# Altium project X98_CARRIER_V1R2.PrjPcb (part 3 of 3)

## Sheet 11 EXPANSION CN.SchDoc
size A3; Organization: Protel International P/L; Address1: L3, 12a Rodborough Rd; Address2: Frenchs Forest; Address3: NSW; Address4: Australia 2086; SPICEModelCacheQOLTSZGZ: <root> / <DocumentId>QOLTSZGZ</DocumentId> / </root>
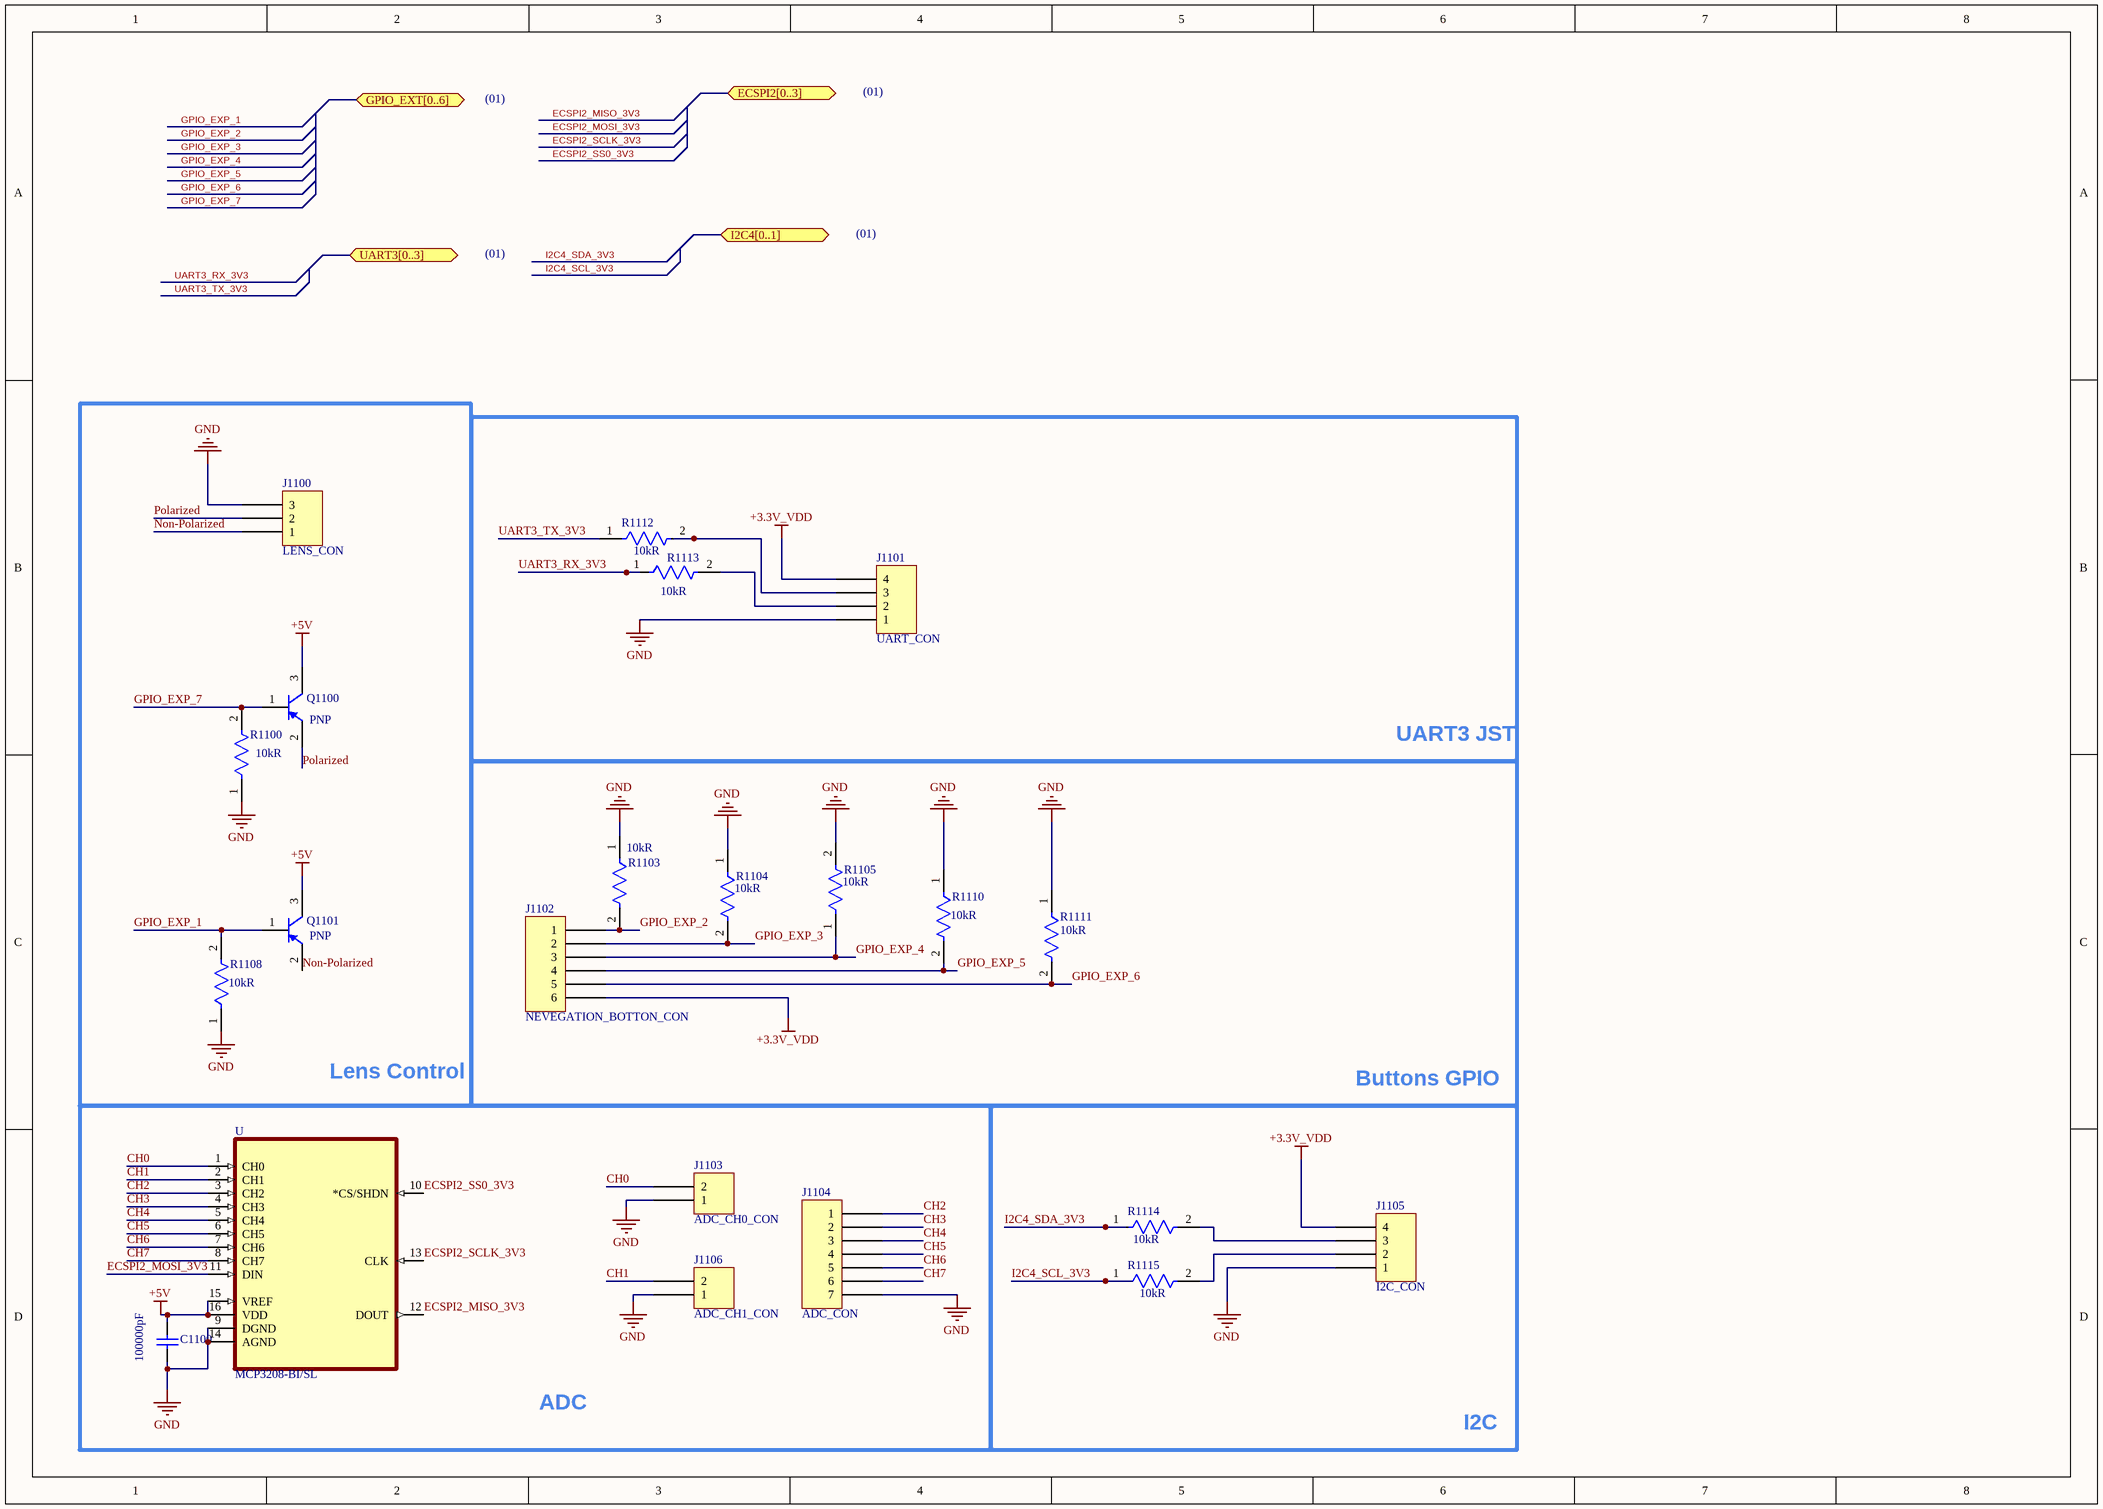
[diagram p13: 11 EXPANSION CN.SchDoc]

### Parts
C1100  Capacitance: 100000pF  [CAPC1050X55X23ML05T13]  (hidden comment: CL05B104KO5NNNC)
J1100  LENS_CON  [HIROSE DF13-3P-1.25H]
J1101  UART_CON  [HIROSE DF13A-4P-1.25H]
J1102  NEVEGATION_BOTTON_CON  [HIROSE DF13A-6P-1.25H]
J1103  ADC_CH0_CON  [HIROSE DF13-2P-1.25H]
J1104  ADC_CON  [JST SM07B-SRSS-TB]
J1105  I2C_CON  [HIROSE DF13A-4P-1.25H]
J1106  ADC_CH1_CON  [HIROSE DF13-2P-1.25H]
Q1100  Polarity: PNP  [ONSC-SOT-23-3-318-08_V]  (hidden comment: BC807-40LT1G)
Q1101  Polarity: PNP  [ONSC-SOT-23-3-318-08_V]  (hidden comment: BC807-40LT1G)
R1100  Resistance: 10kR  [FP-RMCF0603-IPC_C]  (hidden comment: RMCF0603JT10K0)
R1103  Resistance: 10kR  [FP-RMCF0603-IPC_C]  (hidden comment: RMCF0603JT10K0)
R1104  Resistance: 10kR  [FP-RMCF0603-IPC_C]  (hidden comment: RMCF0603JT10K0)
R1105  Resistance: 10kR  [FP-RMCF0603-IPC_C]  (hidden comment: RMCF0603JT10K0)
R1108  Resistance: 10kR  [FP-RMCF0603-IPC_C]  (hidden comment: RMCF0603JT10K0)
R1110  Resistance: 10kR  [FP-RMCF0603-IPC_C]  (hidden comment: RMCF0603JT10K0)
R1111  Resistance: 10kR  [FP-RMCF0603-IPC_C]  (hidden comment: RMCF0603JT10K0)
R1112  Resistance: 10kR  [FP-RMCF0603-IPC_C]  (hidden comment: RMCF0603JT10K0)
R1113  Resistance: 10kR  [FP-RMCF0603-IPC_C]  (hidden comment: RMCF0603JT10K0)
R1114  Resistance: 10kR  [FP-RMCF0603-IPC_C]  (hidden comment: RMCF0603JT10K0)
R1115  Resistance: 10kR  [FP-RMCF0603-IPC_C]  (hidden comment: RMCF0603JT10K0)
U  MCP3208-BI/SL  [SOIC127P600X175-16N]

### Blocks framed on the sheet
Lens Control: J1100 Q1100 Q1101 R1100 R1108
UART3 JST: J1101 R1112 R1113
ADC: C1100 J1103 J1104 J1106 U

### Ports
ECSPI2[0..3] (bidir), GPIO_EXT[0..6] (bidir), I2C4[0..1] (bidir), UART3[0..3] (bidir)

### Nets
+3.3V_VDD: J1101.4 J1102.6 J1105.4
+5V: C1100.2 Q1100.3(C) Q1101.3(C) U.15(VREF) U.16(VDD)
GND: C1100.1 J1100.3 J1101.1 J1103.1 J1104.7 J1105.1 J1106.1 R1100.1 R1103.1 R1104.1 R1105.2 R1108.1 R1110.1 R1111.1 U.9(DGND) U.14(AGND)
CH0: J1103.2 U.1(CH0)
CH1: J1106.2 U.2(CH1)
CH2: J1104.1 U.3(CH2)
CH3: J1104.2 U.4(CH3)
CH4: J1104.3 U.5(CH4)
CH5: J1104.4 U.6(CH5)
CH6: J1104.5 U.7(CH6)
CH7: J1104.6 U.8(CH7)
ECSPI2_MISO_3V3: U.12(DOUT)
ECSPI2_MOSI_3V3: U.11(DIN)
ECSPI2_SCLK_3V3: U.13(CLK)
ECSPI2_SS0_3V3: U.10(*CS/SHDN)
GPIO_EXP_1: Q1101.1(B) R1108.2
GPIO_EXP_2: J1102.1 R1103.2
GPIO_EXP_3: J1102.2 R1104.2
GPIO_EXP_4: J1102.3 R1105.1
GPIO_EXP_5: J1102.4 R1110.2
GPIO_EXP_6: J1102.5 R1111.2
GPIO_EXP_7: Q1100.1(B) R1100.2
I2C4_SCL_3V3: R1115.1
I2C4_SDA_3V3: R1114.1
Non-Polarized: J1100.1 Q1101.2(E)
Polarized: J1100.2 Q1100.2(E)
UART3_RX_3V3: R1113.1
UART3_TX_3V3: R1112.1
NetJ1101_2: J1101.2 R1113.2
NetJ1101_3: J1101.3 R1112.2
NetJ1105_2: J1105.2 R1115.2
NetJ1105_3: J1105.3 R1114.2

### Notes on the sheet
- (01)
- Buttons GPIO
- I2C
- Sheet Title:
- Inventron
- Size:
- Drawn By:
- Revision:
- Project:
- Checked By:
- A4
- Sheet
- of
- Budotek Teknopark
- Dudullu OSB
- Des 2. Cadde No:8/30
- Umraniye / ISTANBUL
- Electronics and Software
- Date:
- Time:
- ©2020 Inventron Electronics and Software. All rights reserved.

### Library data of the parts
C1100 = CMP-2000-05439-1: Chip Capacitor, 100 nF, +/- 10%, 16 V, -55 to 125 degC, 0402 (1005 Metric), RoHS, Tape and Reel; Manufacturer-1: Samsung Electro-Mechanics; Dielectric: X7R; Rated Voltage: 16V; Case Size/Dimension: 0402; Tolerance (%): ±10%; Manufacturer URL: http://www.samsungsem.com/global/index.jsp; Datasheet URL: https://datasheet.ciiva.com/29198/458718-da-01-en-vs-kondensator-0402-29198423.pdf; Datasheet Version: Nov-10; Manufacturer Part Number-1: CL05B104KO5NNNC; Class: Capacitor
J1100 = DF13-3P-1.25H(75): CONN HEADER SMD R/A 3POS 1.25MM; Manufacturer: Hirose Electric Co Ltd; Current Rating (Amps): 1A; Material Flammability Rating: UL94 V-0; Number of Positions: 3; Number of Positions Loaded: All; Pitch - Mating: 0.049" (1.25mm); Shrouding: Shrouded - 4 Wall; Style: Board to Cable/Wire; Voltage Rating: 150V; Part Number: DF13-3P-1.25H(75); ComponentLink1Description: Datasheet; ComponentLink1URL: https://www.hirose.com/product/document?clcode=CL0536-0109-0-76&productname=DF13-10P-1.25DSA(76)&series=DF13&documenttype=Catalog&lang=en&documentid=D31687_en; ComponentLink2Description: DigiKey Link; ComponentLink2URL: //digikey.com/product-detail/en/hirose-electric-co-ltd/DF13-3P-1.25H-75/H126394-ND/9170627; Connector Type: Header; Contact Finish - Mating: Tin; Contact Finish - Post: Tin; Contact Finish Thickness - Mating: 39.4µin (1.00µm); Contact Material: Brass; Contact Shape: Square; Contact Type: Male Pin; Fastening Type: Detent Lock; Features: Board Guide, Solder Retention; Insulation Color: Beige; Insulation Height: 0.142" (3.60mm); Insulation Material: Polyamide (PA), Nylon; LastUpdated: 12/16/2019 7:22:47 PM; Lifecycle Status: 0; Minimum Order: 1; Mounting Type: Surface Mount, Right Angle; Number of Rows: 1; Operating Temperature: -35°C ~ 85°C; Packaging: Tube; PartId: 2; Part Status: Active; Price: 0.41; Series: DF13; Supplier 1: DigiKey; Supplier Part Number 1: H126394-ND; Termination: Solder
J1101 J1105 = DF13A-4P-1.25H(75): CONN HEADER SMD R/A 4POS 1.25MM; Manufacturer: Hirose Electric Co Ltd; Current Rating (Amps): 1A; Material Flammability Rating: UL94 V-0; Number of Positions: 4; Number of Positions Loaded: All; Pitch - Mating: 0.049" (1.25mm); Shrouding: Shrouded - 4 Wall; Style: Board to Cable/Wire; Voltage Rating: 150V; Part Number: DF13A-4P-1.25H(75); ComponentLink1Description: Datasheet; ComponentLink1URL: https://www.hirose.com/product/download/?distributor=digikey&type=specSheet&lang=en&num=DF13A-4P-1.25H(75); ComponentLink2Description: DigiKey Link; ComponentLink2URL: //digikey.com/product-detail/en/hirose-electric-co-ltd/DF13A-4P-1.25H-75/H126438-ND/9170678; Connector Type: Header; Contact Finish - Mating: Tin; Contact Finish - Post: Tin; Contact Finish Thickness - Mating: 39.4µin (1.00µm); Contact Material: Brass; Contact Shape: Square; Contact Type: Male Pin; Fastening Type: Detent Lock; Features: Solder Retention; Insulation Color: Beige; Insulation Height: 0.142" (3.60mm); Insulation Material: Polyamide (PA), Nylon; LastUpdated: 12/16/2019 7:34:28 PM; Lifecycle Status: 0; Minimum Order: 1; Mounting Type: Surface Mount, Right Angle; Number of Rows: 1; Operating Temperature: -35°C ~ 85°C; Packaging: Tube; PartId: 8; Part Status: Active; Price: 0.45; Series: DF13; Supplier 1: DigiKey; Supplier Part Number 1: H126438-ND; Termination: Solder
J1102 = DF13A-6P-1.25H(75): CONN HEADER SMD R/A 6POS 1.25MM; Manufacturer: Hirose Electric Co Ltd; Current Rating (Amps): 1A; Material Flammability Rating: UL94 V-0; Number of Positions: 6; Number of Positions Loaded: All; Pitch - Mating: 0.049" (1.25mm); Shrouding: Shrouded - 4 Wall; Style: Board to Cable/Wire; Voltage Rating: 150V; Part Number: DF13A-6P-1.25H(75); ComponentLink1Description: Datasheet; ComponentLink1URL: https://www.hirose.com/product/document?clcode=CL0536-0109-0-76&productname=DF13-10P-1.25DSA(76)&series=DF13&documenttype=Catalog&lang=en&documentid=D31687_en; ComponentLink2Description: DigiKey Link; ComponentLink2URL: http://digikey.com/product-detail/en/hirose-electric-co-ltd/DF13A-6P-1.25H-75/H126442-ND/9170682; Connector Type: Header; Contact Finish - Mating: Tin; Contact Finish - Post: Tin; Contact Finish Thickness - Mating: 39.4µin (1.00µm); Contact Material: Brass; Contact Shape: Square; Contact Type: Male Pin; Fastening Type: Detent Lock; Features: Solder Retention; Insulation Color: Beige; Insulation Height: 0.142" (3.60mm); Insulation Material: Polyamide (PA), Nylon; LastUpdated: 1/15/2020 3:36:45 AM; Lifecycle Status: Active; Minimum Order: 1; Mounting Type: Surface Mount, Right Angle; Number of Rows: 1; Operating Temperature: -35°C ~ 85°C; Packaging: Tube; PartId: 10; Part Status: Active; Price: 0.51; Series: DF13; Supplier 1: DigiKey; Supplier Part Number 1: H126442-ND; Termination: Solder
J1103 J1106 = DF13-2P-1.25H(75): CONN HEADER SMD R/A 2POS 1.25MM; Manufacturer: Hirose Electric Co Ltd; Current Rating (Amps): 1A; Material Flammability Rating: UL94 V-0; Number of Positions: 2; Number of Positions Loaded: All; Pitch - Mating: 0.049" (1.25mm); Shrouding: Shrouded - 4 Wall; Style: Board to Cable/Wire; Voltage Rating: 150V; Part Number: DF13-2P-1.25H(75); ComponentLink1Description: Datasheet; ComponentLink1URL: https://www.hirose.com/product/document?clcode=CL0536-0109-0-76&productname=DF13-10P-1.25DSA(76)&series=DF13&documenttype=Catalog&lang=en&documentid=D31687_en; ComponentLink2Description: DigiKey Link; ComponentLink2URL: //digikey.com/product-detail/en/hirose-electric-co-ltd/DF13-2P-1.25H-75/H126389-ND/9170621; Connector Type: Header; Contact Finish - Mating: Tin; Contact Finish - Post: Tin; Contact Finish Thickness - Mating: 39.4µin (1.00µm); Contact Material: Brass; Contact Shape: Square; Contact Type: Male Pin; Fastening Type: Detent Lock; Features: Board Guide, Solder Retention; Insulation Color: Beige; Insulation Height: 0.142" (3.60mm); Insulation Material: Polyamide (PA), Nylon; LastUpdated: 12/16/2019 7:22:19 PM; Lifecycle Status: 0; Minimum Order: 1; Mounting Type: Surface Mount, Right Angle; Number of Rows: 1; Operating Temperature: -35°C ~ 85°C; Packaging: Tube; PartId: 1; Part Status: Active; Price: 0.37; Series: DF13; Supplier 1: DigiKey; Supplier Part Number 1: H126389-ND; Termination: Solder
J1104 = SM07B-SRSS-TB(LF)(SN): CONN HEADER SMD R/A 7POS 1MM; Manufacturer: JST Sales America Inc.; Current Rating (Amps): 0.7A; Material Flammability Rating: UL94 V-0; Number of Positions: 7; Number of Positions Loaded: All; Pitch - Mating: 0.039" (1.00mm); Shrouding: Shrouded - 4 Wall; Style: Board to Cable/Wire; Voltage Rating: 50V; Part Number: SM07B-SRSS-TB(LF)(SN); ComponentLink1Description: Datasheet; ComponentLink1URL: http://www.jst-mfg.com/product/pdf/eng/eSH.pdf; ComponentLink2Description: DigiKey Link; ComponentLink2URL: http://digikey.com/product-detail/en/jst-sales-america-inc/SM07B-SRSS-TB-LF-SN/455-1807-1-ND/926878; Connector Type: Header; Contact Finish - Mating: Tin; Contact Finish - Post: Tin; Contact Material: Copper Alloy; Contact Shape: Square; Contact Type: Male Pin; Fastening Type: Push-Pull; Features: Solder Retention; Insulation Color: Natural; Insulation Height: 0.114" (2.90mm); Insulation Material: Polyamide (PA), Nylon; LastUpdated: 1/12/2020 11:42:26 PM; Lifecycle Status: Active; Minimum Order: 1; Mounting Type: Surface Mount, Right Angle; Number of Rows: 1; Operating Temperature: -25°C ~ 85°C; Packaging: TapeAndReel; PartId: 65; Part Status: Active; Price: 0.39; Series: SR; Supplier 1: DigiKey; Supplier Part Number 1: 455-1807-1-ND; Termination: Solder
Q1100 Q1101 = CMP-1048-00745-1: General Purpose Transistor, PNP Silicon, 3-Pin SOT-23, Pb-Free, Tape and Reel; Manufacturer-1: On Semiconductor; fT Min (MHz): 100; IC Continuous (A): -0.5; Mounting Technology: Surface Mount; ComponentLink3URL: http://www.onsemi.cn/pub_link/Collateral/318-08.PDF; Manufacturer Part Number-1: BC807-40LT1G; DatasheetVersion: Rev. 10; RoHS: TRUE; ComponentLink1URL: http://www.onsemi.com/; ComponentLink2URL: http://www.onsemi.com/pub_link/Collateral/BC807-16LT1-D.PDF; ComponentLink1Description: Manufacturer URL; ComponentLink3Description: Package Specification; PackageVersion: Rev. AP, 11/2009; PackageReference: SOT-23-3-318-08; PackageDescription: 3-Pin Small Outline Transistor, Body 2.92 x 1.3 mm, Pitch 0.95 mm; Packing: Tape and Reel; ComponentLink2Description: Datasheet; Class: Transistor
R1100 R1103-R1105 R1108 R1110-R1115 = CMP-26527-002098-1: 10kΩ ±5% 0.1W 0603 Thick Film Chip Resistor AEC-Q200 compliant; Manufacturer-1: Stackpole Electronics Inc; Power Rating: 100mW; Temperature Coefficient: 100ppm/°C; Radiation Hardening: No; Military Standard: Not; Mount: Surface Mount; Resistor Type: Thick Film; Size Code: 0603; Case/Package: 0603; Min Operating Temperature: -55°C; Construction: Rectangular; Series: RMCF; Width: 0.031inch; Length: 1.55mm; Case Code (Metric): 1608; Depth: 0.8mm; Height: 0.022inch; Packaging: Tape and Reel; Lead Free: Lead Free; Tolerance: 5%; Case Code (Imperial): 0603; Max Operating Temperature: 155°C; Contact Plating: Tin; Max Power Dissipation: 100mW; Features: Automotive AEC-Q200; Number of Terminations: 2; Manufacturer Part Number-1: RMCF0603JT10K0; Class: Resistor
U = MCP3208-BI/SL: 12 Bit Analog to Digital Converter 4, 8 Input 1 SAR 16-SOIC; Manufacturer-1: Microchip; Class: ICs; Value: *; Manufacturer Part Number-1: MCP3208-BI/SL; Package: SOIC-16 Microchip; Availability: Unavailable; SnapEDA_Link: https://www.snapeda.com/parts/MCP3208-BI/SL/Microchip/view-part/1037416/?ref=snap; Price: None

## Sheet 12 CONSOLE.SchDoc
size A4
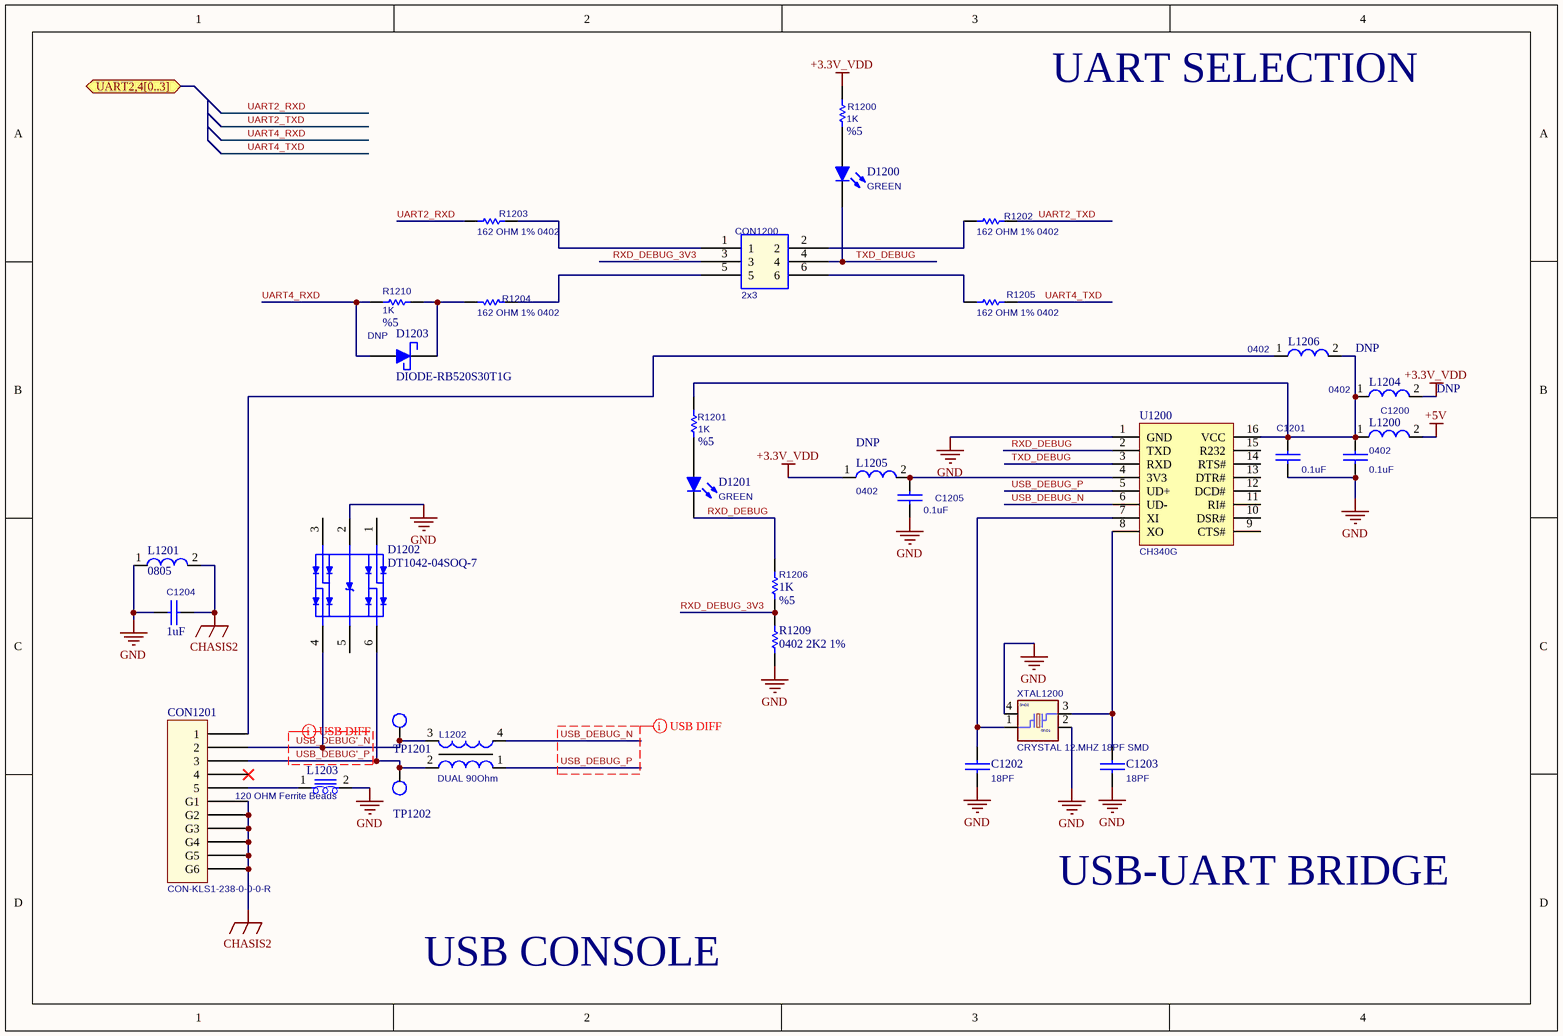
[diagram p14: 12 CONSOLE.SchDoc]

### Parts
C1200  0.1uF  [0402_CC]
C1201  0.1uF  [0402_CC]
C1202  18PF  [0402_CC]
C1203  18PF  [0402_CC]
C1204  1uF  [0603_CC]
C1205  0.1uF  [0402_CC]
CON1200  2x3  [HEADER 2.54 X 3x2]
CON1201  CON-KLS1-238-0-0-0-R  [KLS1-238-0-0-0-R]
D1200  GREEN  [0603_LED]
D1201  GREEN  [0603_LED]
D1202  DT1042-04SOQ-7  [DIODE-DT1042-04SOQ-7]
D1203  DIODE-RB520S30T1G  [SOD523]
L1200  0402  [0402_RES]
L1201  0805  [0805]
L1202  DUAL 90Ohm  [DLW21H]
L1203  120 OHM Ferrite Beads  [0603_RES]
L1204  0402  ASSY_OPT: DNP  [0402_RES]  (no BOM)
L1205  0402  ASSY_OPT: DNP  [0402_RES]  (no BOM)
L1206  0402  ASSY_OPT: DNP  [0402_RES]  (no BOM)
R1200  1K  Tolerance: %5  [0402_RES]
R1201  1K  Tolerance: %5  [0402_RES]
R1202  162 OHM 1% 0402  [0402_RES]
R1203  162 OHM 1% 0402  [0402_RES]
R1204  162 OHM 1% 0402  [0402_RES]
R1205  162 OHM 1% 0402  [0402_RES]
R1206  1K  Tolerance: %5  [0402_RES]
R1209  0402 2K2 1%  [0402_RES]
R1210  1K  ASSY_OPT: DNP  Tolerance: %5  [0402_RES]  (no BOM)
TP1201  TEST POINT 15  [testpoint_15]  (value not drawn)  (no BOM)
TP1202  TEST POINT 15  [testpoint_15]  (value not drawn)  (no BOM)
U1200  CH340G  [CH340G]
XTAL1200  CRYSTAL 12.MHZ 18PF SMD  [XTLOSC4_3P2X2P5MM_SM]

### Ports
UART2,4[0..3] (bidir)

### Nets
+3.3V_VDD: L1204.2 L1205.1 R1200.1
+5V: L1200.2
CHASIS2: C1204.1 CON1201.G1 CON1201.G2 CON1201.G3 CON1201.G4 CON1201.G5 CON1201.G6 L1201.2
GND: C1200.2 C1201.2 C1202.2 C1203.2 C1204.2 C1205.2 D1202.2(VSS) L1201.1 L1203.2 R1209.1 U1200.1(GND) XTAL1200.2(GND1) XTAL1200.4(GND2)
RXD_DEBUG: D1201.2(K) R1206.2 U1200.2(TXD)
RXD_DEBUG_3V3: CON1200.3 R1206.1 R1209.2
TXD_DEBUG: CON1200.4 D1200.2(K) U1200.3(RXD)
UART2_RXD: R1203.1
UART2_TXD: R1202.2
UART4_RXD: D1203.1(A) R1210.1
UART4_TXD: R1205.2
USB_DEBUG'_N: CON1201.2 D1202.4(IO3) L1202.3 TP1201.1
USB_DEBUG'_P: CON1201.3 D1202.6(IO4) L1202.2 TP1202.1
USB_DEBUG_N: L1202.4 U1200.6(UD-)
USB_DEBUG_P: L1202.1 U1200.5(UD+)
NetC1200_1: C1200.1 C1201.1 L1200.1 L1204.1 L1206.2 R1201.1 U1200.16(VCC)
NetC1202_1: C1202.1 U1200.7(XI) XTAL1200.1
NetC1203_1: C1203.1 U1200.8(XO) XTAL1200.3
NetC1205_1: C1205.1 L1205.2 U1200.4(3V3)
NetCON1200_1: CON1200.1 R1203.2
NetCON1200_2: CON1200.2 R1202.1
NetCON1200_5: CON1200.5 R1204.2
NetCON1200_6: CON1200.6 R1205.1
NetCON1201_1: CON1201.1 L1206.1
NetCON1201_5: CON1201.5 L1203.1
NetD1200_1: D1200.1(A) R1200.2
NetD1201_1: D1201.1(A) R1201.2
NetD1203_2: D1203.2(K) R1204.1 R1210.2

Not connected (* = marked no-connect by the designer): CON1201 4*; D1202 1(IO1) 3(IO2) 5(VCC); U1200 9(CTS#) 10(DSR#) 11(RI#) 12(DCD#) 13(DTR#) 14(RTS#) 15(R232)

### Layout directives
differential pair; differential pair class USB 90 OHM DIFF: USB_DEBUG'_N, USB_DEBUG'_P, USB_DEBUG_N, USB_DEBUG_P

### Notes on the sheet
- UART SELECTION
- USB-UART BRIDGE
- USB CONSOLE
- Sheet Title:
- Inventron
- Size:
- Drawn By:
- Revision:
- Project:
- Checked By:
- A4
- Sheet
- of
- Budotek Teknopark
- Dudullu OSB
- Des 2. Cadde No:8/30
- Umraniye / ISTANBUL
- Electronics and Software
- Date:
- Time:
- ©2020 Inventron Electronics and Software. All rights reserved.

### Library data of the parts
C1200 C1201 C1205 = CAP-CL05B104KO5NNNC: CAP VER 0.1UF 16V X7R 0402; Manufacturer-1: SAMSUNG; Opt. Temp.: -55/+125; Class: Capacitor; Manufacturer Part Number-1: CL05B104KO5NNNC; Footprint: 0402; Manufacturer-2: *; Manufacturer Part Number-2: *; Inventron Stock No: *; Created By: LA; Created Date: 23.11.2018; Checked By: *; ASSY_OPT: *; Dimensions: *; Unit Price: 0,00499; Revision Date/Note: *; Price Break: 10K
C1202 C1203 = CAP-GCM1555C1H180JA16D: CAP CER 18PF 50V C0G/NP0 0402; Manufacturer-1: Murata Electronics; Class: Capacitor; Manufacturer Part Number-1: GCM1555C1H180JA16D; Footprint: *; Manufacturer-2: *; Manufacturer Part Number-2: *; Inventron Stock No: *; Created By: *; Created Date: *; Checked By: *; ASSY_OPT: *; Dimensions: *; Unit Price: *; Revision Date/Note: *; Price Break: *; Opt. Temp.: *; Features: *
C1204 = CAP-CL10B105KA8NNNC: CAP CER 1UF 25V X7R 0603; Manufacturer-1: SAMSUNG; Class: Capacitor; Manufacturer Part Number-1: CL10B105KA8NNNC; Footprint: *; Manufacturer-2: *; Manufacturer Part Number-2: *; Inventron Stock No: *; Created By: LA; Created Date: *; Checked By: *; ASSY_OPT: *; Dimensions: *; Unit Price: *; Revision Date/Note: *; Price Break: *; Opt. Temp.: *; Features: *
CON1200 = CON-6 PIN 2.54MM: 2x3 6 PIN 2.54MM HEADER; Manufacturer: Wurth Electronics; Manufacturer Part Number: 61300621121; Class: Connector; Manufacturer Part Number-1: *; Footprint: *; Manufacturer-1: *; Manufacturer-2: *; Manufacturer Part Number-2: *; Inventron Stock No: *; Created By: *; Created Date: *; Checked By: *; ASSY_OPT: *; Dimensions: *; Unit Price: *; Revision Date/Note: *; Price Break: *; Opt. Temp.: *
CON1201 = CON-KLS1-238-0-0-0-R: Manufacturer-1: KLS; Class: Connector; Manufacturer Part Number-1: KLS1-238-0-0-0-R; Footprint: *; Manufacturer-2: *; Manufacturer Part Number-2: *; Inventron Stock No: *; Created By: OKS,EE; Created Date: *; Checked By: *; ASSY_OPT: *; Dimensions: *; Unit Price: 0.085,0.078; Revision Date/Note: *; Price Break: 1000,5000; Opt. Temp.: *; Features: *
D1200 D1201 = LED-LTST-C190KRKT: LED SMD 0603 SUPER GREEN; Manufacturer-1: LITEON; Manufacturer Part Number-1: LTST-C190KRKT; Footprint: *; Manufacturer-2: *; Manufacturer Part Number-2: *; Inventron Stock No: *; Created By: *; Created Date: *; Checked By: *; ASSY_OPT: *; Dimensions: *; Unit Price: 0.03343; Revision Date/Note: *; Price Break: 4000; Opt. Temp.: *; Class: Led; Features: *
D1202 = DIODE-DT1042-04SOQ-7: HDMI TVS DIODE; Manufacturer-1: Diodes Incorporated; Opt. Temp.: -55°C ~ 85°C (TA); Manufacturer Part Number-1: DT1042-04SOQ-7; Footprint: SOT26; Manufacturer-2: *; Manufacturer Part Number-2: *; Inventron Stock No: *; Created By: E.E; Created Date: 23.10.2020; Checked By: *; ASSY_OPT: *; Dimensions: *; Unit Price: 0.07575; Revision Date/Note: *; Price Break: 3000; Class: Diode
D1203 = DIODE-RB520S30T1G: DIODE SCHOTTKY 30V 200MA SOD523; Manufacturer-1: ON SEMI; Opt. Temp.: -55/+150; Manufacturer Part Number-1: RB520S30T1G; Footprint: SOD-523; Manufacturer-2: *; Manufacturer Part Number-2: *; Inventron Stock No: *; Created By: LA; Created Date: 23.11.2018; Checked By: *; ASSY_OPT: *; Dimensions: *; Unit Price: 0,0324; Revision Date/Note: *; Price Break: 3K; Class: Diode
L1200 L1204-L1206 = IND-FERRITE (RES 0 OHM) 0402: 0OHM 0402; Manufacturer Part Number-1: RMCF0402ZT0R00; Manufacturer-1: Stackpole Electronics Inc; Class: Inductor; Footprint: 0402; Manufacturer-2: *; Inventron Stock No: *; Created By: EE; Checked By: *; Dimensions: *; Unit Price: 0.00186; Revision Date/Note: *; Price Break: 1000
  L1200: ASSY_OPT: *
L1201 = IND-FERRITE (RES 0 OHM) 0805: 0OHM 0805; Manufacturer Part Number-1: AC0805JR-070RL; Manufacturer-1: YAGEO; Class: Inductor; Manufacturer-2: *; Inventron Stock No: *; Created By: EE; Checked By: *; ASSY_OPT: *; Dimensions: *; Revision Date/Note: *
L1202 = IND-DLW21HN900SQ2L: Common Mode Chokes Dual 90Ohm 100MHz 0.33A 0.35Ohm DCR SMD T/R; Manufacturer-1: Murata Manufacturing; Class: Inductor; Manufacturer Part Number-1: DLW21HN900SQ2L; Footprint: *; Manufacturer-2: *; Manufacturer Part Number-2: *; Inventron Stock No: *; Created By: E.E; Created Date: 2.11.2020; Checked By: *; ASSY_OPT: *; Dimensions: *; Unit Price: 0.185; Revision Date/Note: *; Price Break: 3000; Opt. Temp.: *; Features: *
L1203 = IND-BLM18PG121SH1D: Ferrite Beads Multi-Layer 120Ohm 25% 100MHz 2A 0.05Ohm DCR 0603 Automotive T/R; Manufacturer-1: Murata Manufacturing; Class: Inductor; Manufacturer Part Number-1: BLM18PG121SH1D; Footprint: 0603; Manufacturer-2: *; Manufacturer Part Number-2: *; Inventron Stock No: *; Created By: E.E; Created Date: 2.11.2020; Checked By: *; ASSY_OPT: *; Dimensions: *; Unit Price: 0.02550; Revision Date/Note: *; Price Break: 4000; Opt. Temp.: *; Features: *
R1200 R1201 R1206 R1210 = RES-RMCF0402JT1K00: RES 1K OHM 5% 1/16W 0402; Manufacturer-1: STACKPOLE; Opt. Temp.: -55/+155; Class: Resistor; Manufacturer Part Number-1: RMCF0402JT1K00; Footprint: 0402; Manufacturer-2: *; Manufacturer Part Number-2: *; Inventron Stock No: *; Created By: LA; Created Date: 23.11.2018; Checked By: *; Dimensions: *; Unit Price: 0,00127; Revision Date/Note: *; Price Break: 10K
  R1200 R1201 R1206: ASSY_OPT: *
R1202-R1205 = RES-ERJ-2RKF1620X: 162 ±1% 0.1W, 1/10W Chip Resistor 0402 (1005 Metric) Automotive AEC-Q200 Thick Film; Manufacturer-1: Panasonic Electronic Components; Manufacturer Part Number-1: ERJ-2RKF1620X; Footprint: 0402; Manufacturer-2: *; Manufacturer Part Number-2: *; Inventron Stock No: *; Created By: E.E; Created Date: 8.11.2020; Checked By: *; ASSY_OPT: *; Dimensions: *; Unit Price: *; Revision Date/Note: *; Price Break: *; Opt. Temp.: *; Class: Resistor; Tolerance: *
R1209 = RES-CRGCQ0402F2K2: 2.2 ±1% 0.063W, 1/16W Chip Resistor 0402 (1005 Metric) Automotive AEC-Q200, Moisture Resistant Thick Film; Manufacturer-1: TE Connectivity Passive Product; Opt. Temp.: -55°C ~ 155°C; Manufacturer Part Number-1: CRGCQ0402F2K2; Footprint: 0402; Manufacturer-2: *; Manufacturer Part Number-2: *; Inventron Stock No: *; Created By: E.E; Created Date: 22.10.2020; Checked By: *; ASSY_OPT: *; Dimensions: *; Unit Price: *; Revision Date/Note: *; Price Break: *; Class: Resistor; Tolerance: *
U1200 = IC-CH340G: IC-340 USB INTERFACE SO16; Manufacturer-1: ÖZDİSAN; Class: ICs; Manufacturer Part Number-1: CH340G; Footprint: S016; Manufacturer-2: *; Manufacturer Part Number-2: *; Inventron Stock No: *; Created By: E.E.; Created Date: 16.10.2020; Checked By: *; ASSY_OPT: *; Dimensions: *; Unit Price: 0.35; Revision Date/Note: *; Price Break: 5000; Opt. Temp.: *
XTAL1200 = XTAL-FA-238V 12.0000MB50X-C0: CRYSTAL 12.0000MHZ 18PF SMD; Manufacturer-1: EPSON; Opt. Temp.: +40/+85; Manufacturer Part Number-1: FA-238V 12.0000MB50X-C0; Footprint: 4-SMD; Manufacturer-2: *; Manufacturer Part Number-2: *; Inventron Stock No: *; Created By: E.E; Created Date: 20.10.2020; Checked By: *; ASSY_OPT: *; Dimensions: *; Unit Price: 0.6; Revision Date/Note: *; Price Break: 1K; Class: Crystal

## Sheet 01 SoM IO INTERFACE.SchDoc
size A2
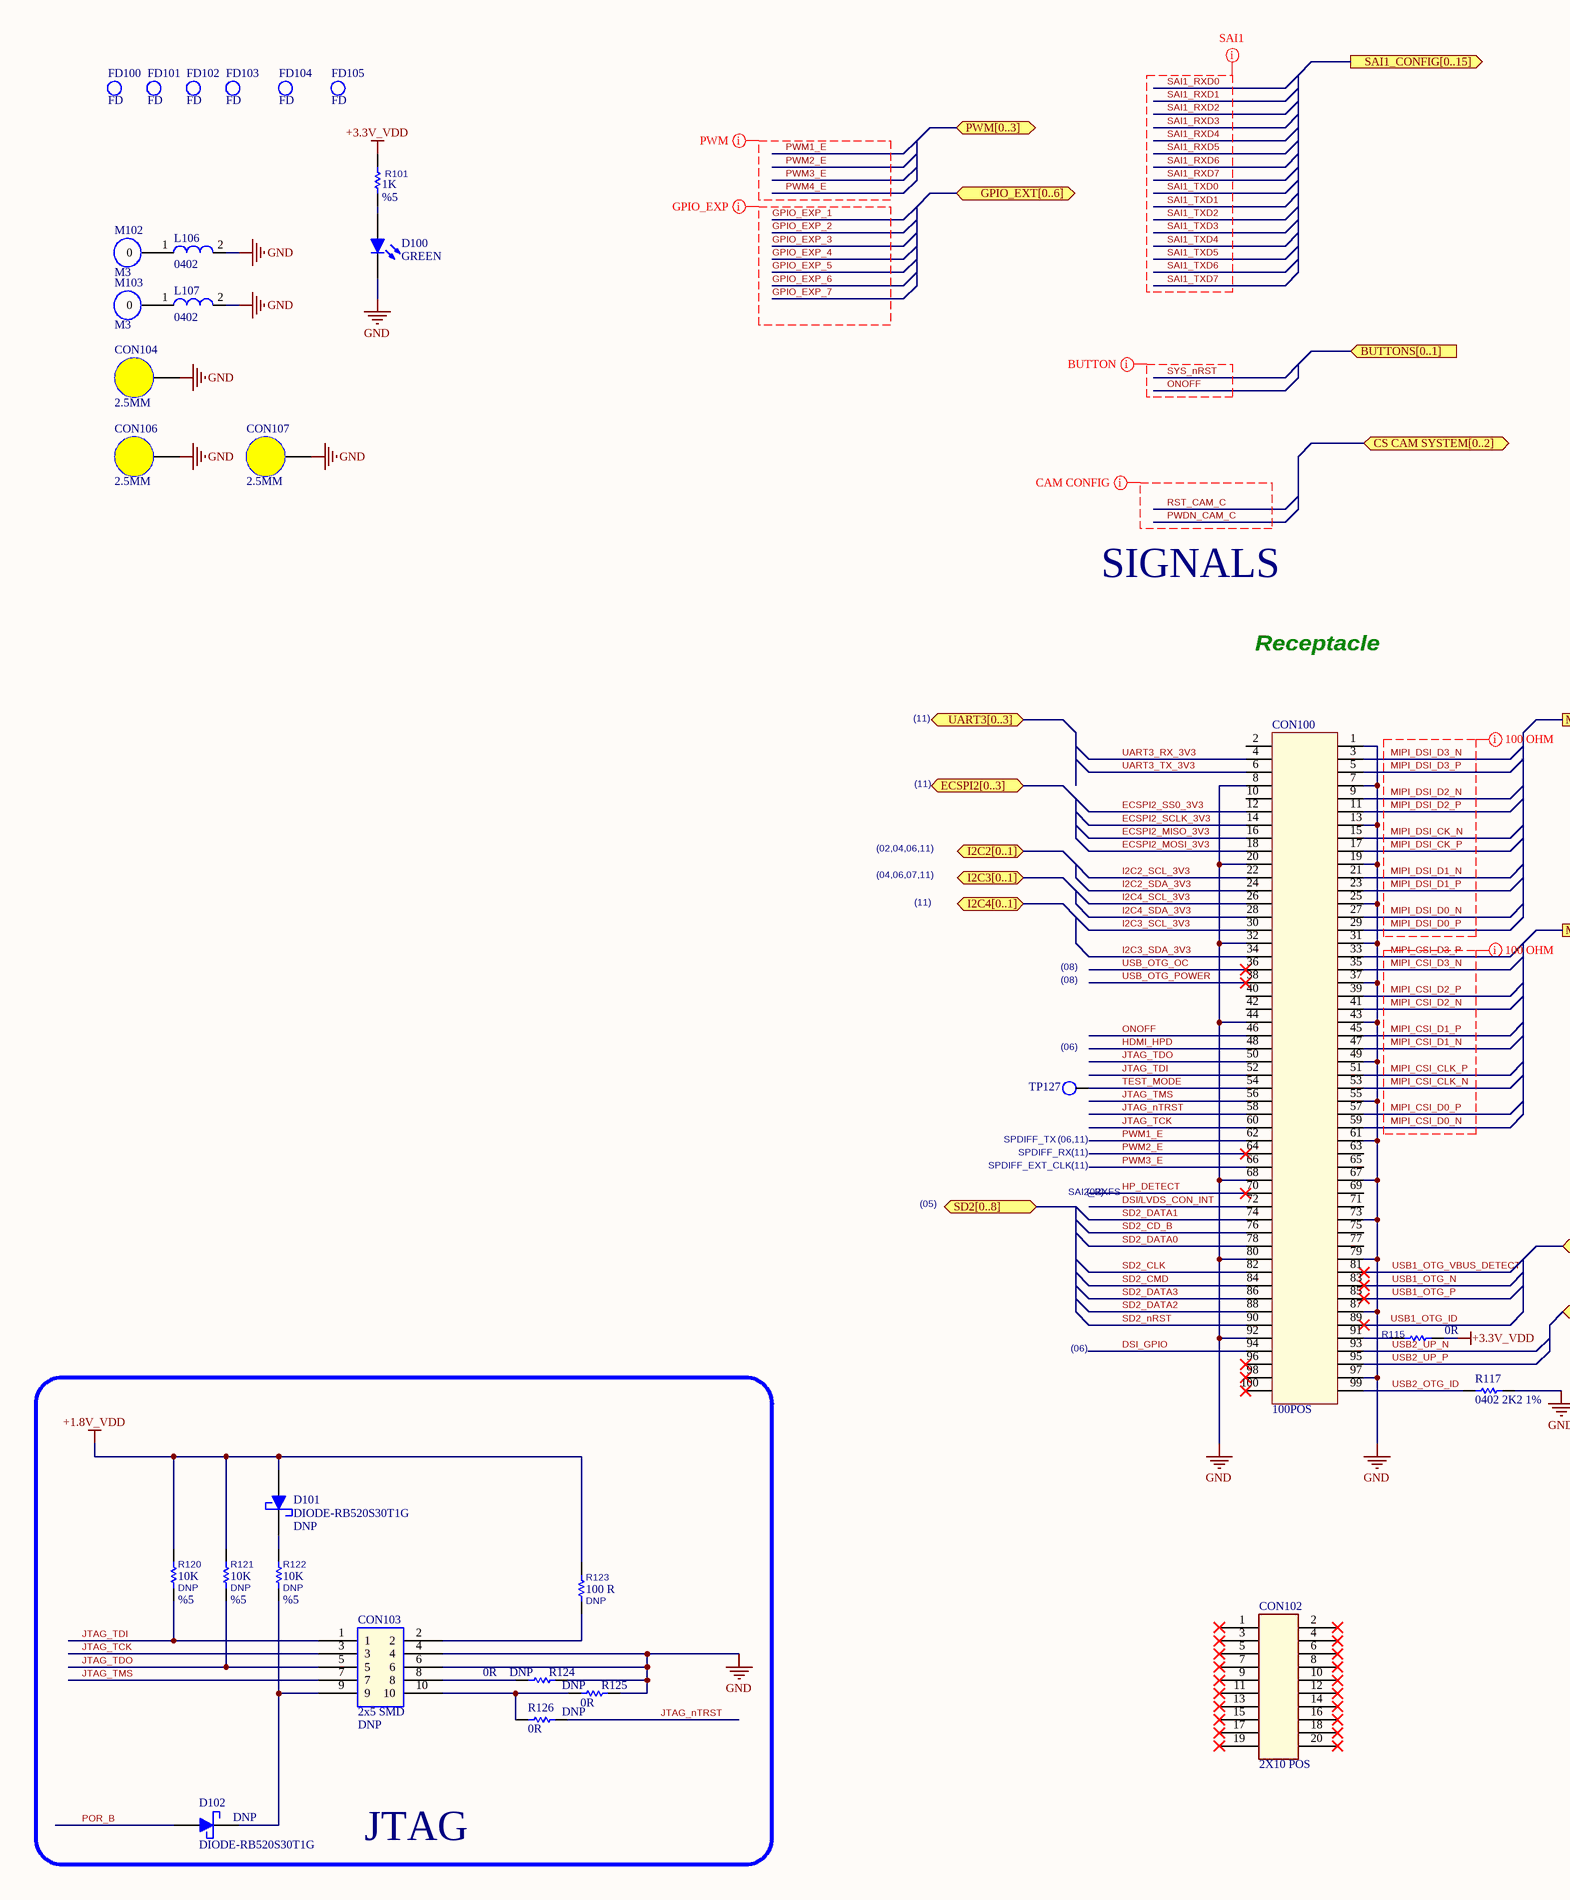
[diagram p15: 01 SoM IO INTERFACE.SchDoc, left]
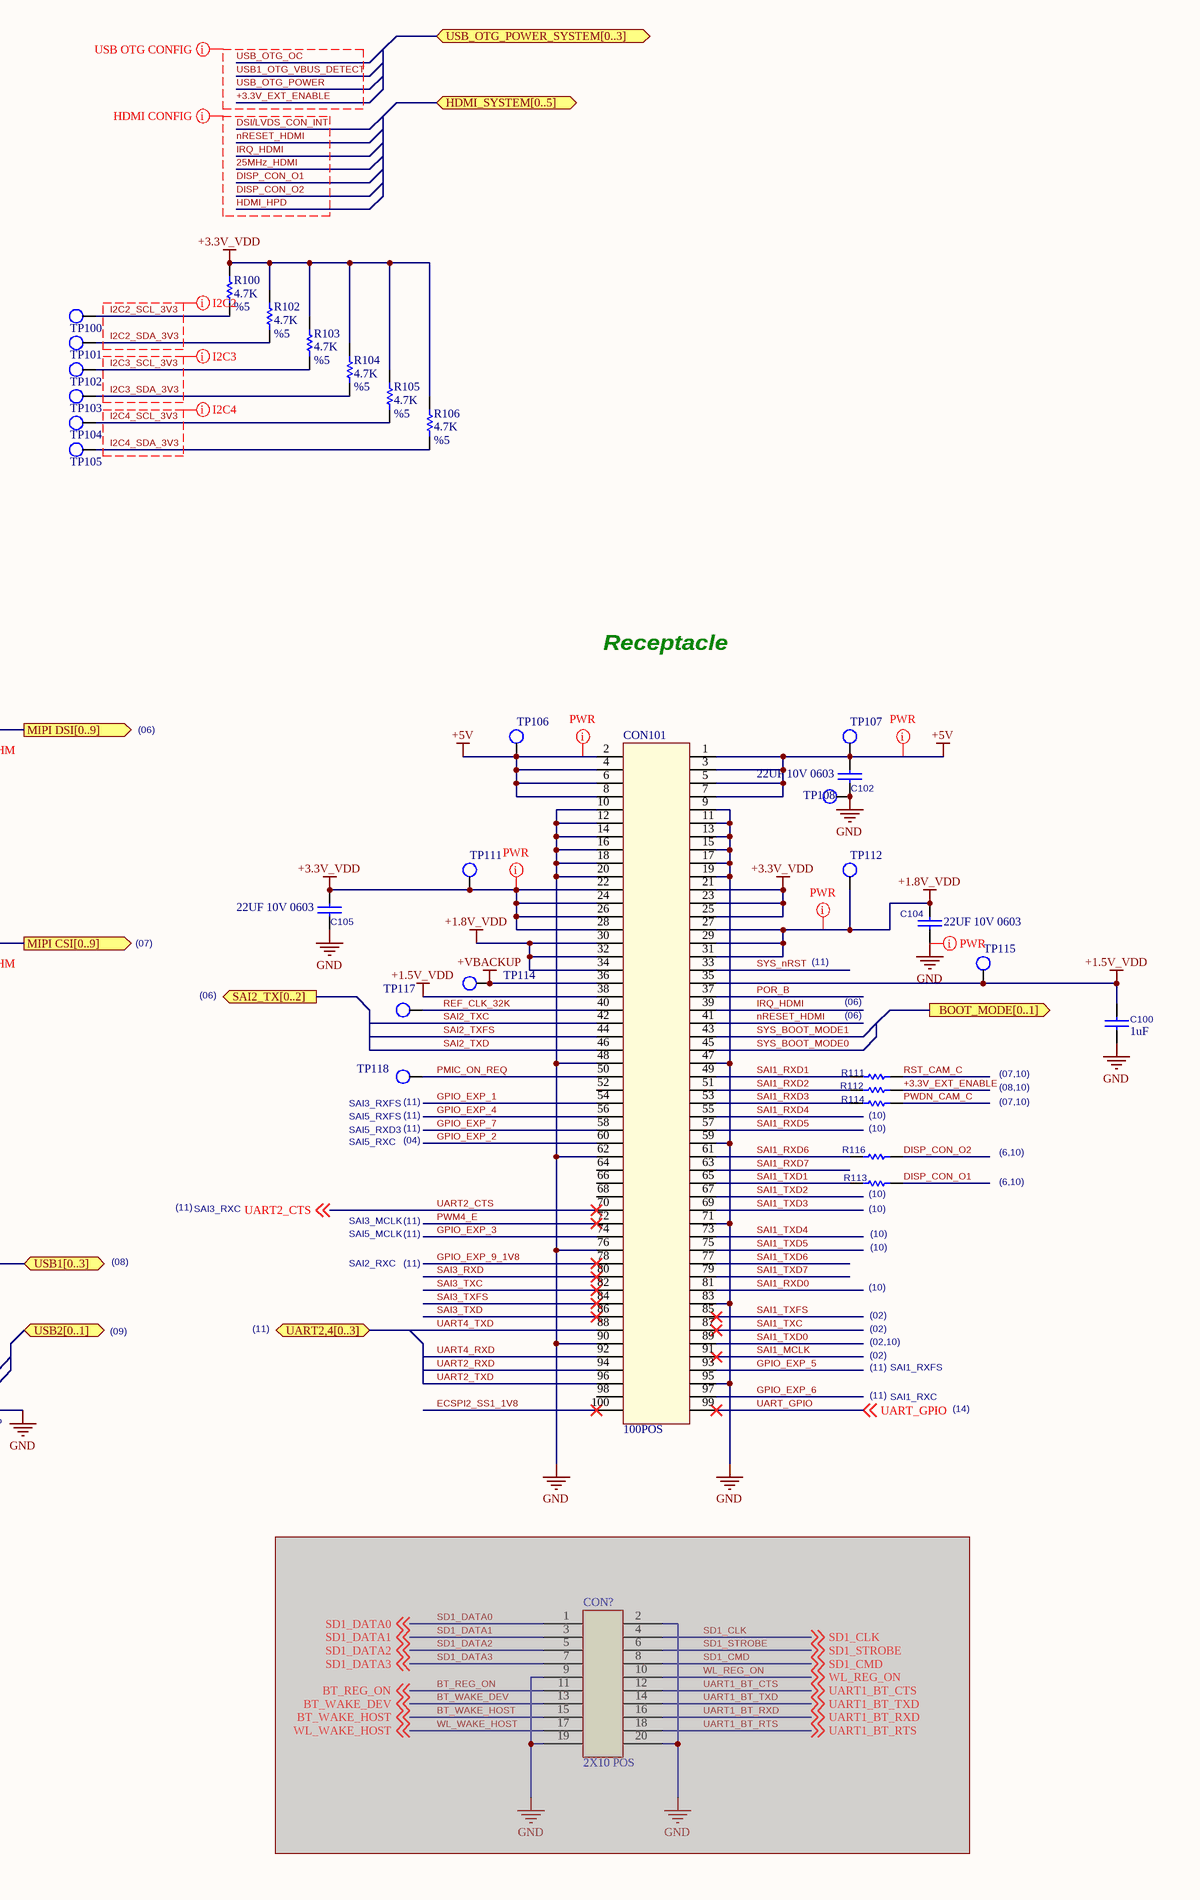
[diagram p16: 01 SoM IO INTERFACE.SchDoc, right]

### Parts
C100  1uF  [0603_CC]
C102  22UF 10V 0603  [0603_CC]
C104  22UF 10V 0603  [0603_CC]
C105  22UF 10V 0603  [0603_CC]
CON100  100POS  [DF40C-100DS- FEMALE]
CON101  100POS  [DF40C-100DS- FEMALE]
CON102  2X10 POS  [HRS_DF40C-20DS-0.4V(51)]
CON103  2x5 SMD  ASSY_OPT: DNP  [HEADER 2X5 1.27MM THD]  (no BOM)
CON104  2.5MM  [9774030151R]
CON106  2.5MM  [9774030151R]
CON107  2.5MM  [9774030151R]
CON?  2X10 POS  [DF40C-20DS-0.4V(51)]  (masked out: inside a compile mask, not in the netlist)
D100  GREEN  [0603_LED]
D101  DIODE-RB520S30T1G  ASSY_OPT: DNP  [SOD523]  (no BOM)
D102  DIODE-RB520S30T1G  ASSY_OPT: DNP  [SOD523]  (no BOM)
FD100  FD  [FD]
FD101  FD  [FD]
FD102  FD  [FD]
FD103  FD  [FD]
FD104  FD  [FD]
FD105  FD  [FD]
L106  0402  [0402_RES]
L107  0402  [0402_RES]
M102  M3  [M3]  (no BOM)
M103  M3  [M3]  (no BOM)
R100  4.7K  Tolerance: %5  [0402_RES]
R101  1K  Tolerance: %5  [0402_RES]
R102  4.7K  Tolerance: %5  [0402_RES]
R103  4.7K  Tolerance: %5  [0402_RES]
R104  4.7K  Tolerance: %5  [0402_RES]
R105  4.7K  Tolerance: %5  [0402_RES]
R106  4.7K  Tolerance: %5  [0402_RES]
R111  0402 330R 5%  [0402_RES]  (value not drawn)
R112  0402 330R 5%  [0402_RES]  (value not drawn)
R113  0402 330R 5%  [0402_RES]  (value not drawn)
R114  0402 330R 5%  [0402_RES]  (value not drawn)
R115  0R  [0402_RES]
R116  0402 330R 5%  [0402_RES]  (value not drawn)
R117  0402 2K2 1%  [0402_RES]
R120  10K  ASSY_OPT: DNP  Tolerance: %5  [0402_RES]  (no BOM)
R121  10K  ASSY_OPT: DNP  Tolerance: %5  [0402_RES]  (no BOM)
R122  10K  ASSY_OPT: DNP  Tolerance: %5  [0402_RES]  (no BOM)
R123  100 R  ASSY_OPT: DNP  [0603_RES]  (no BOM)
R124  0R  ASSY_OPT: DNP  [0402_RES]  (no BOM)
R125  0R  ASSY_OPT: DNP  [0402_RES]  (no BOM)
R126  0R  ASSY_OPT: DNP  [0402_RES]  (no BOM)
TP100  TEST POINT 35  [testpoint_35mil]  (value not drawn)  (no BOM)
TP101  TEST POINT 35  [testpoint_35mil]  (value not drawn)  (no BOM)
TP102  TEST POINT 35  [testpoint_35mil]  (value not drawn)  (no BOM)
TP103  TEST POINT 35  [testpoint_35mil]  (value not drawn)  (no BOM)
TP104  TEST POINT 35  [testpoint_35mil]  (value not drawn)  (no BOM)
TP105  TEST POINT 35  [testpoint_35mil]  (value not drawn)  (no BOM)
TP106  TEST POINT 35  [testpoint_35mil]  (value not drawn)  (no BOM)
TP107  TEST POINT 35  [testpoint_35mil]  (value not drawn)  (no BOM)
TP108  TEST POINT 35  [testpoint_35mil]  (value not drawn)  (no BOM)
TP111  TEST POINT 35  [testpoint_35mil]  (value not drawn)  (no BOM)
TP112  TEST POINT 35  [testpoint_35mil]  (value not drawn)  (no BOM)
TP114  TEST POINT 35  [testpoint_35mil]  (value not drawn)  (no BOM)
TP115  TEST POINT 35  [testpoint_35mil]  (value not drawn)  (no BOM)
TP117  TEST POINT 15  [testpoint_15]  (value not drawn)  (no BOM)
TP118  TEST POINT 15  [testpoint_15]  (value not drawn)  (no BOM)
TP127  TEST POINT 35  [testpoint_35mil]  (value not drawn)  (no BOM)

### Blocks framed on the sheet
JTAG: CON103 D101 D102 R120-R126

### Ports
BOOT_MODE[0..1] (out), BUTTONS[0..1] (in), CS CAM SYSTEM[0..2] (bidir), ECSPI2[0..3] (bidir), GPIO_EXT[0..6] (bidir), HDMI_SYSTEM[0..5] (bidir), I2C2[0..1] (bidir), I2C3[0..1] (bidir), I2C4[0..1] (bidir), MIPI CSI[0..9] (out), MIPI DSI[0..9] (out), PWM[0..3] (bidir), SAI1_CONFIG[0..15] (out), SAI2_TX[0..2] (out), SD2[0..8] (bidir), UART2,4[0..3] (bidir), UART3[0..3] (bidir), USB1[0..3] (bidir), USB2[0..1] (bidir), USB_OTG_POWER_SYSTEM[0..3] (bidir)

### Nets
+1.5V_VDD: C100.2 CON101.35(P35) CON101.38(P38) TP115.1
+1.8V_VDD: C104.1 CON101.27(P27) CON101.29(P29) CON101.30(P30) CON101.31(P31) CON101.32(P32) CON101.34(P34) D101.1(A) R120.2 R121.2 R123.2 TP112.1
+3.3V_VDD: C105.1 CON101.21(P21) CON101.22(P22) CON101.23(P23) CON101.24(P24) CON101.25(P25) CON101.26(P26) CON101.28(P28) R100.2 R101.1 R102.2 R103.2 R104.2 R105.2 R106.2 R115.1 TP111.1
+5V: C102.1 CON101.1(P1) CON101.2(P2) CON101.3(P3) CON101.4(P4) CON101.5(P5) CON101.6(P6) CON101.7(P7) CON101.8(P8) TP106.1 TP107.1
+VBACKUP: CON101.36(P36) TP114.1
GND: C100.1 C102.2 C104.2 C105.2 CON100.1(P1) CON100.7(P7) CON100.8(P8) CON100.13(P13) CON100.19(P19) CON100.20(P20) CON100.25(P25) CON100.31(P31) CON100.32(P32) CON100.37(P37) CON100.43(P43) CON100.44(P44) CON100.49(P49) CON100.55(P55) CON100.61(P61) CON100.67(P67) CON100.68(P68) CON100.73(P73) CON100.79(P79) CON100.80(P80) CON100.87(P87) CON100.92(P92) CON100.97(P97) CON101.9(P9) CON101.10(P10) CON101.11(P11) CON101.12(P12) CON101.13(P13) CON101.14(P14) CON101.15(P15) CON101.16(P16) CON101.17(P17) CON101.18(P18) CON101.19(P19) CON101.20(P20) CON101.47(P47) CON101.48(P48) CON101.59(P59) CON101.62(P62) CON101.71(P71) CON101.76(P76) CON101.83(P83) CON101.90(P90) CON101.95(P95) CON103.4 CON103.6 CON104.0 CON106.0 CON107.0 D100.2(K) L106.2 L107.2 R117.2 R124.2 R125.2 TP108.1
+3.3V_EXT_ENABLE: R112.2
DISP_CON_O1: R113.1
DISP_CON_O2: R116.1
DSI/LVDS_CON_INT: CON100.72(P72)
DSI_GPIO: CON100.94(P94)
ECSPI2_MISO_3V3: CON100.16(P16)
ECSPI2_MOSI_3V3: CON100.18(P18)
ECSPI2_SCLK_3V3: CON100.14(P14)
ECSPI2_SS0_3V3: CON100.12(P12)
ECSPI2_SS1_1V8: CON101.100(P100)
GPIO_EXP_1: CON101.54(P54)
GPIO_EXP_2: CON101.60(P60)
GPIO_EXP_3: CON101.74(P74)
GPIO_EXP_4: CON101.56(P56)
GPIO_EXP_5: CON101.93(P93)
GPIO_EXP_6: CON101.97(P97)
GPIO_EXP_7: CON101.58(P58)
GPIO_EXP_9_1V8: CON101.78(P78)
HDMI_HPD: CON100.48(P48)
HP_DETECT: CON100.70(P70)
I2C2_SCL_3V3: CON100.22(P22) R100.1 TP100.1
I2C2_SDA_3V3: CON100.24(P24) R102.1 TP101.1
I2C3_SCL_3V3: CON100.30(P30) R103.1 TP102.1
I2C3_SDA_3V3: CON100.34(P34) R104.1 TP103.1
I2C4_SCL_3V3: CON100.26(P26) R105.1 TP104.1
I2C4_SDA_3V3: CON100.28(P28) R106.1 TP105.1
IRQ_HDMI: CON101.39(P39)
JTAG_nTRST: CON100.58(P58) R126.2
JTAG_TCK: CON100.60(P60) CON103.3
JTAG_TDI: CON100.52(P52) CON103.1 R120.1
JTAG_TDO: CON100.50(P50) CON103.5 R121.1
JTAG_TMS: CON100.56(P56) CON103.7
MIPI_CSI_CLK_N: CON100.53(P53)
MIPI_CSI_CLK_P: CON100.51(P51)
MIPI_CSI_D0_N: CON100.59(P59)
MIPI_CSI_D0_P: CON100.57(P57)
MIPI_CSI_D1_N: CON100.47(P47)
MIPI_CSI_D1_P: CON100.45(P45)
MIPI_CSI_D2_N: CON100.41(P41)
MIPI_CSI_D2_P: CON100.39(P39)
MIPI_CSI_D3_N: CON100.35(P35)
MIPI_CSI_D3_P: CON100.33(P33)
MIPI_DSI_CK_N: CON100.15(P15)
MIPI_DSI_CK_P: CON100.17(P17)
MIPI_DSI_D0_N: CON100.27(P27)
MIPI_DSI_D0_P: CON100.29(P29)
MIPI_DSI_D1_N: CON100.21(P21)
MIPI_DSI_D1_P: CON100.23(P23)
MIPI_DSI_D2_N: CON100.9(P9)
MIPI_DSI_D2_P: CON100.11(P11)
MIPI_DSI_D3_N: CON100.3(P3)
MIPI_DSI_D3_P: CON100.5(P5)
nRESET_HDMI: CON101.41(P41)
ONOFF: CON100.46(P46)
PMIC_ON_REQ: CON101.50(P50) TP118.1
POR_B: CON101.37(P37) D102.1(A)
PWDN_CAM_C: R114.2
PWM1_E: CON100.62(P62)
PWM2_E: CON100.64(P64)
PWM3_E: CON100.66(P66)
PWM4_E: CON101.72(P72)
REF_CLK_32K: CON101.40(P40) TP117.1
RST_CAM_C: R111.2
SAI1_MCLK: CON101.91(P91)
SAI1_RXD0: CON101.81(P81)
SAI1_RXD1: CON101.49(P49) R111.1
SAI1_RXD2: CON101.51(P51) R112.1
SAI1_RXD3: CON101.53(P53) R114.1
SAI1_RXD4: CON101.55(P55)
SAI1_RXD5: CON101.57(P57)
SAI1_RXD6: CON101.61(P61) R116.2
SAI1_RXD7: CON101.63(P63)
SAI1_TXC: CON101.87(P87)
SAI1_TXD0: CON101.89(P89)
SAI1_TXD1: CON101.65(P65) R113.2
SAI1_TXD2: CON101.67(P67)
SAI1_TXD3: CON101.69(P69)
SAI1_TXD4: CON101.73(P73)
SAI1_TXD5: CON101.75(P75)
SAI1_TXD6: CON101.77(P77)
SAI1_TXD7: CON101.79(P79)
SAI1_TXFS: CON101.85(P85)
SAI2_TXC: CON101.42(P42)
SAI2_TXD: CON101.46(P46)
SAI2_TXFS: CON101.44(P44)
SAI3_RXD: CON101.80(P80)
SAI3_TXC: CON101.82(P82)
SAI3_TXD: CON101.86(P86)
SAI3_TXFS: CON101.84(P84)
SD2_CD_B: CON100.76(P76)
SD2_CLK: CON100.82(P82)
SD2_CMD: CON100.84(P84)
SD2_DATA0: CON100.78(P78)
SD2_DATA1: CON100.74(P74)
SD2_DATA2: CON100.88(P88)
SD2_DATA3: CON100.86(P86)
SD2_nRST: CON100.90(P90)
SYS_BOOT_MODE0: CON101.45(P45)
SYS_BOOT_MODE1: CON101.43(P43)
SYS_nRST: CON101.33(P33)
TEST_MODE: CON100.54(P54) TP127.1
UART2_CTS: CON101.70(P70) ; off-sheet UART2_CTS
UART2_RXD: CON101.94(P94)
UART2_TXD: CON101.96(P96)
UART3_RX_3V3: CON100.4(P4)
UART3_TX_3V3: CON100.6(P6)
UART4_RXD: CON101.92(P92)
UART4_TXD: CON101.88(P88)
UART_GPIO: CON101.99(P99) ; off-sheet UART_GPIO
USB1_OTG_ID: CON100.89(P89)
USB1_OTG_N: CON100.83(P83)
USB1_OTG_P: CON100.85(P85)
USB1_OTG_VBUS_DETECT: CON100.81(P81)
USB2_OTG_ID: CON100.99(P99) R117.1
USB2_UP_N: CON100.93(P93)
USB2_UP_P: CON100.95(P95)
USB_OTG_OC: CON100.36(P36)
USB_OTG_POWER: CON100.38(P38)
NetCON100_91: CON100.91(P91) R115.2
NetCON103_2: CON103.2 R123.1
NetCON103_8: CON103.8 R124.1
NetCON103_9: CON103.9 D102.2(K) R122.1
NetCON103_10: CON103.10 R125.1 R126.1
NetD100_1: D100.1(A) R101.2
NetD101_2: D101.2(K) R122.2
NetL106_1: L106.1 M102.0
NetL107_1: L107.1 M103.0

Not connected (* = marked no-connect by the designer): CON100 2(P2) 10(P10) 40(P40) 42(P42) 63(P63) 65(P65) 69(P69) 71(P71) 75(P75) 77(P77) 96(P96)* 98(P98)* 100(P100)*; CON101 52(P52) 64(P64) 66(P66) 68(P68) 98(P98); CON102 1* 2* 3* 4* 5* 6* 7* 8* 9* 10* 11* 12* 13* 14* 15* 16* 17* 18* 19* 20*

### Layout directives
differential pair; differential pair class DIFF DSI 100 OHM; net class MIPI DSI: MIPI_DSI_CK_N, MIPI_DSI_CK_P, MIPI_DSI_D0_N, MIPI_DSI_D0_P, MIPI_DSI_D1_N, MIPI_DSI_D1_P, MIPI_DSI_D2_N, MIPI_DSI_D2_P, MIPI_DSI_D3_N, MIPI_DSI_D3_P
differential pair; differential pair class DIFF CSI 100 OHM; net class MIPI CSI: MIPI_CSI_CLK_N, MIPI_CSI_CLK_P, MIPI_CSI_D0_N, MIPI_CSI_D0_P, MIPI_CSI_D1_N, MIPI_CSI_D1_P, MIPI_CSI_D2_N, MIPI_CSI_D2_P, MIPI_CSI_D3_N, MIPI_CSI_D3_P
net class SAI1: SAI1_RXD0, SAI1_RXD1, SAI1_RXD2, SAI1_RXD3, SAI1_RXD4, SAI1_RXD5, SAI1_RXD6, SAI1_RXD7, SAI1_TXD0, SAI1_TXD1, SAI1_TXD2, SAI1_TXD3, SAI1_TXD4, SAI1_TXD5, SAI1_TXD6, SAI1_TXD7
net class PWM: PWM1_E, PWM2_E, PWM3_E, PWM4_E
net class GPIO_EXP: GPIO_EXP_1, GPIO_EXP_2, GPIO_EXP_3, GPIO_EXP_4, GPIO_EXP_5, GPIO_EXP_6, GPIO_EXP_7
net class CAM CONFIG: PWDN_CAM_C, RST_CAM_C
net class BUTTON: ONOFF, SYS_nRST
net class HDMI CONFIG: 25MHz_HDMI, DISP_CON_O1, DISP_CON_O2, DSI/LVDS_CON_INT, HDMI_HPD, IRQ_HDMI, nRESET_HDMI
net class USB OTG CONFIG: +3.3V_EXT_ENABLE, USB1_OTG_VBUS_DETECT, USB_OTG_OC, USB_OTG_POWER
net class I2C2: I2C2_SCL_3V3, I2C2_SDA_3V3
net class I2C3: I2C3_SCL_3V3, I2C3_SDA_3V3
net class I2C4: I2C4_SCL_3V3, I2C4_SDA_3V3
net class PWR: +1.8V_VDD, +3.3V_VDD, +5V, GND

### Notes on the sheet
- SIGNALS
- Receptacle
- (11)
- (06)
- (02,04,06,11)
- (04,06,07,11)
- (07)
- (08)
- (near TP115) (03)
- (near TP127) (06)
- (08,10)
- (07,10)
- SPDIFF_TX
- (near TP127) (06,11)
- (near TP118) SAI5_RXD3
- (near TP118) SAI3_RXFS
- (near TP118) SAI5_RXFS
- SAI5_RXC
- (near TP118) (11)
- (04)
- (near R114) (10)
- (10)
- (6,10)
- (05)
- SPDIFF_EXT_CLK
- SPDIFF_RX
- SAI2_RXFS
- (02)
- SAI3_RXC
- SAI3_MCLK
- (near R113) (10)
- 04
- SAI2_RXC
- SAI5_MCLK
- (09)
- (02,10)
- SAI1_RXFS
- SAI1_RXC
- (14)
- Sheet Title:
- Project:
- Inventron
- Electronics and Software
- Size:
- Date:
- Drawn By:
- Revision:
- Checked By:
- A4
- Sheet
- Time:
- of
- Budotek Teknopark
- Dudullu OSB
- Des 2. Cadde No:8/30
- ©2020 Inventron Electronics and Software. All rights reserved.
- Umraniye / ISTANBUL

### Library data of the parts
C100 = CAP-CL10B105KA8NNNC: as C1204 on sheet 12 CONSOLE; Manufacturer Part Number-1: CL10B105KA8NNNC; Footprint: *; Manufacturer-2: *; Manufacturer Part Number-2: *; Inventron Stock No: *; Created By: LA; Created Date: *; Checked By: *; ASSY_OPT: *; Dimensions: *; Unit Price: *; Revision Date/Note: *; Price Break: *; Opt. Temp.: *; Features: *
C102 C104 C105 = CAP-C1608X5R1A226M080AC: ±20% 10V Ceramic Capacitor X5R 0603 (1608 Metric); Manufacturer-1: Murata Electronics; Manufacturer Part Number-1: C1608X5R1A226M080AC; Footprint: 0603; Manufacturer-2: *; Manufacturer Part Number-2: *; Inventron Stock No: *; Created By: E.E; Created Date: 2.11.2020; Checked By: *; ASSY_OPT: *; Dimensions: *; Unit Price: *; Revision Date/Note: *; Price Break: *; Opt. Temp.: *; Class: Capacitor; Features: *
CON100 CON101 = CON-DF40C-100DS-0.4V(51): CONN HDR 100POS 0.4MM SMD GOLD; Manufacturer-1: HIROSE; Class: Connector; Manufacturer Part Number-1: DF40C-100DS-0.4V(51); Footprint: 100POS 0.4MM; Manufacturer-2: *; Manufacturer Part Number-2: *; Inventron Stock No: *; Created By: EE; Created Date: 18.11.2020; Checked By: *; ASSY_OPT: *; Dimensions: *; Unit Price: 0.85; Revision Date/Note: *; Price Break: 5K
CON102 CON? = CON-DF40C-20DS-0.4V(51): CONN RCPT 20POS SMD GOLD; Manufacturer-1: Hirose Electric Co Ltd; Class: Connector; Manufacturer Part Number-1: DF40C-20DS-0.4V(51); Footprint: 2X10; Manufacturer-2: *; Manufacturer Part Number-2: *; Inventron Stock No: *; Created By: E.E; Created Date: 8.10.2020; Checked By: *; ASSY_OPT: *; Dimensions: *; Unit Price: 0.27550; Revision Date/Note: *; Price Break: 5000; Opt. Temp.: *; Features: *
CON103 = CON-10 PIN 2.54MM TH: 10 PIN 1.27 SMD; Class: Connector; Manufacturer Part Number-1: *; Footprint: *; Manufacturer-1: *; Manufacturer-2: *; Manufacturer Part Number-2: *; Inventron Stock No: *; Created By: *; Created Date: *; Checked By: *; Dimensions: *; Unit Price: *; Revision Date/Note: *; Price Break: *; Opt. Temp.: *
CON104 CON106 CON107 = CON-9774030151R: RND STANDOFF M2X0.4 STEEL 2.5MM; Manufacturer-1: Würth Elektronik; Class: Connector; Manufacturer Part Number-1: 9774030151R; Footprint: *; Manufacturer-2: *; Manufacturer Part Number-2: *; Inventron Stock No: *; Created By: *; Created Date: *; Checked By: *; ASSY_OPT: *; Dimensions: *; Unit Price: 0.7; Revision Date/Note: *; Price Break: 700; Opt. Temp.: *; Features: *
D100 = LED-LTST-C190KRKT: as D1200 on sheet 12 CONSOLE; Manufacturer Part Number-1: LTST-C190KRKT; Footprint: *; Manufacturer-2: *; Manufacturer Part Number-2: *; Inventron Stock No: *; Created By: *; Created Date: *; Checked By: *; ASSY_OPT: *; Dimensions: *; Unit Price: 0.03343; Revision Date/Note: *; Price Break: 4000; Opt. Temp.: *; Class: Led; Features: *
D101 D102 = DIODE-RB520S30T1G: as D1203 on sheet 12 CONSOLE; Manufacturer Part Number-1: RB520S30T1G; Footprint: SOD-523; Manufacturer-2: *; Manufacturer Part Number-2: *; Inventron Stock No: *; Created By: LA; Created Date: 23.11.2018; Checked By: *; Dimensions: *; Unit Price: 0,0324; Revision Date/Note: *; Price Break: 3K; Class: Diode
FD100-FD105 = FD: Manufacturer Part Number-1: "; Footprint: "; Manufacturer-1: "; Manufacturer-2: *; Manufacturer Part Number-2: *; Inventron Stock No: *; Created By: "; Created Date: "; Checked By: *; ASSY_OPT: *; Dimensions: *; Unit Price: "; Revision Date/Note: *; Price Break: "; Opt. Temp.: "; Class: "
L106 L107 = IND-FERRITE (RES 0 OHM) 0402: as L1200 on sheet 12 CONSOLE; Footprint: 0402; Manufacturer-2: *; Inventron Stock No: *; Created By: EE; Checked By: *; ASSY_OPT: *; Dimensions: *; Unit Price: 0.00186; Revision Date/Note: *; Price Break: 1000
M102 M103 = CON-M3 SCREW: M3 SCREW
R100 R102-R106 = RES-4.7K: RES 4.7K OHM 5% 1/16W 0402; Manufacturer Part Number-1: RC0402JR-074K7L; Manufacturer-1: Yageo; Opt. Temp.: -55/+155; Class: Resistor; Footprint: 0402; Manufacturer-2: *; Manufacturer Part Number-2: *; Inventron Stock No: *; Created By: LA; Checked By: *; ASSY_OPT: *; Dimensions: *; Revision Date/Note: *
R101 = RES-RMCF0402JT1K00: as R1200 on sheet 12 CONSOLE; Manufacturer Part Number-1: RMCF0402JT1K00; Footprint: 0402; Manufacturer-2: *; Manufacturer Part Number-2: *; Inventron Stock No: *; Created By: LA; Created Date: 23.11.2018; Checked By: *; ASSY_OPT: *; Dimensions: *; Unit Price: 0,00127; Revision Date/Note: *; Price Break: 10K
R111-R114 R116 = RES-CRGCQ0402J330R: 330 ±5% 0.063W, 1/16W Chip Resistor 0402 (1005 Metric) Automotive AEC-Q200, Moisture Resistant Thick Film; Manufacturer-1: TE Connectivity Passive Product; Opt. Temp.: -55°C ~ 155°C; Tolerance: %5; Manufacturer Part Number-1: CRGCQ0402J330R; Footprint: 0402; Manufacturer-2: *; Manufacturer Part Number-2: *; Inventron Stock No: *; Created By: E.E; Created Date: 23.10.2020; Checked By: *; ASSY_OPT: *; Dimensions: *; Unit Price: *; Revision Date/Note: *; Price Break: *; Class: Resistor
R115 R124-R126 = RES-RMCF0402ZT0R00: RES 0 OHM JUMPER 1/16W 0402; Manufacturer-1: STACKPOLE; Opt. Temp.: -55/+155; Class: Resistor; Manufacturer Part Number-1: RMCF0402ZT0R00; Footprint: 0402; Manufacturer-2: *; Manufacturer Part Number-2: *; Inventron Stock No: *; Created By: LA; Created Date: 23.11.2018; Checked By: *; Dimensions: *; Unit Price: 0,00127; Revision Date/Note: *; Price Break: 10K
  R115: ASSY_OPT: *
R117 = RES-CRGCQ0402F2K2: as R1209 on sheet 12 CONSOLE; Manufacturer Part Number-1: CRGCQ0402F2K2; Footprint: 0402; Manufacturer-2: *; Manufacturer Part Number-2: *; Inventron Stock No: *; Created By: E.E; Created Date: 22.10.2020; Checked By: *; ASSY_OPT: *; Dimensions: *; Unit Price: *; Revision Date/Note: *; Price Break: *; Class: Resistor; Tolerance: *
R120-R122 = RES-RMCF0402JT10K0: RES 10K OHM 5% 1/16W 0402; Manufacturer-1: STACKPOLE; Opt. Temp.: -55/+155; Class: Resistor; Manufacturer Part Number-1: RMCF0402JT10K0; Footprint: 0402; Manufacturer-2: *; Manufacturer Part Number-2: *; Inventron Stock No: *; Created By: LA; Created Date: 23.11.2018; Checked By: *; Dimensions: *; Unit Price: 0,00127; Revision Date/Note: *; Price Break: 10K
R123 = RES-RMCF0603FT100R: RES 100 OHM %1 1/10W 0603; Manufacturer-1: STACKPOLE; Opt. Temp.: -55/+155; Class: Resistor; Manufacturer Part Number-1: RMCF0603FT100R; Footprint: 0603; Manufacturer-2: *; Manufacturer Part Number-2: *; Inventron Stock No: *; Created By: LA; Created Date: *; Checked By: *; Dimensions: *; Unit Price: *; Revision Date/Note: *; Price Break: *; Features: AUTOMOTIVE; Tolerance: *

## Sheet 00 PCB SPEC.SchDoc
size A2
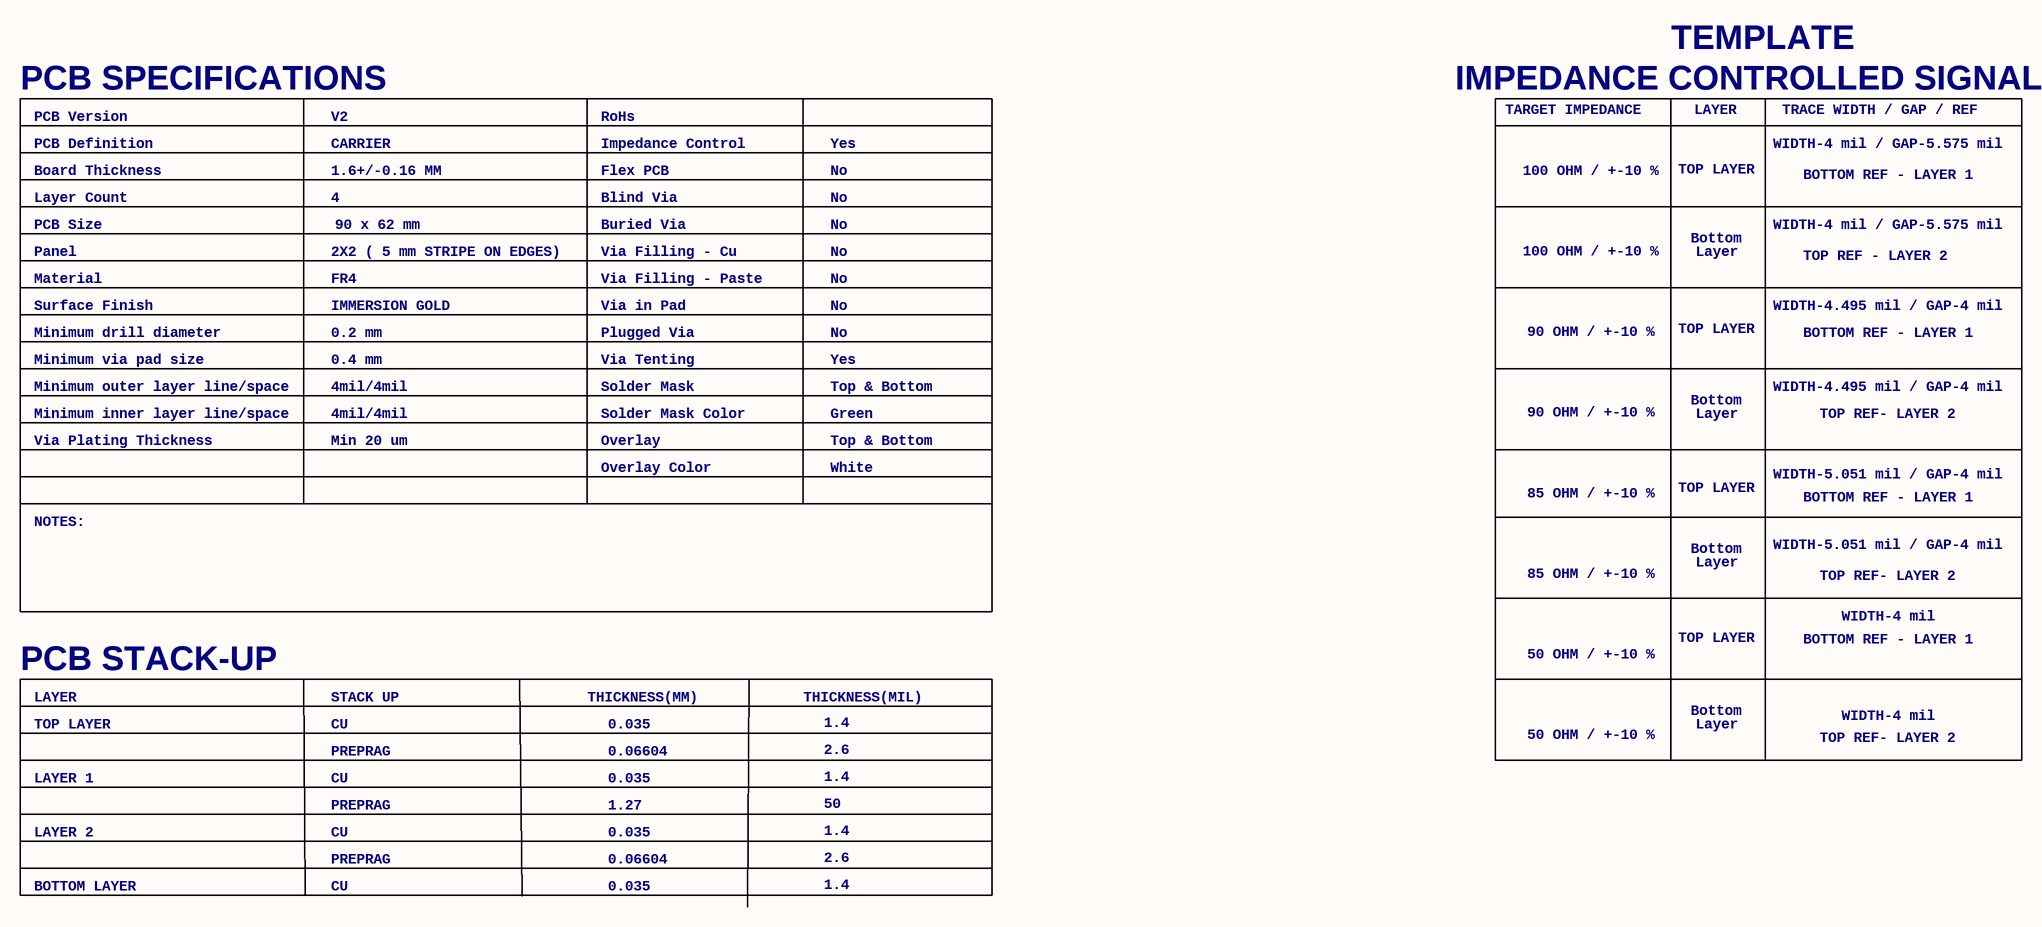
[diagram p17: 00 PCB SPEC.SchDoc]

### Notes on the sheet
- TEMPLATE
- PCB SPECIFICATIONS
- PCB Version
- V2
- RoHs
- IMPEDANCE CONTROLLED SIGNALS
- TARGET IMPEDANCE
- LAYER
- TRACE WIDTH / GAP / REF
- Board Thickness
- Layer Count
- PCB Definition
- 1.6+/-0.16 MM
- 4
- CARRIER
- Impedance Control
- Flex PCB
- Blind Via
- Yes
- No
- 100 OHM / +-10 %
- TOP LAYER
- WIDTH-4 mil / GAP-5.575 mil
- BOTTOM REF - LAYER 1
- PCB Size
- Panel
- 2X2 ( 5 mm STRIPE ON EDGES)
- 90 x 62 mm
- Buried Via
- Via Filling - Cu
- Bottom
- Layer
- TOP REF - LAYER 2
- Material
- Minimum drill diameter
- Surface Finish
- FR4
- IMMERSION GOLD
- 0.2 mm
- Via Filling - Paste
- Via in Pad
- Plugged Via
- 90 OHM / +-10 %
- WIDTH-4.495 mil / GAP-4 mil
- Minimum via pad size
- Minimum outer layer line/space
- 0.4 mm
- 4mil/4mil
- Via Tenting
- Solder Mask
- Top & Bottom
- Minimum inner layer line/space
- Via Plating Thickness
- Min 20 um
- Solder Mask Color
- Overlay
- Overlay Color
- Green
- White
- WIDTH-5.051 mil / GAP-4 mil
- TOP REF- LAYER 2
- NOTES:
- 85 OHM / +-10 %
- PCB STACK-UP
- 50 OHM / +-10 %
- WIDTH-4 mil
- STACK UP
- CU
- THICKNESS(MM)
- 0.035
- THICKNESS(MIL)
- 1.4
- LAYER 1
- PREPRAG
- 0.06604
- 1.27
- 2.6
- 50
- LAYER 2
- BOTTOM LAYER
- Sheet Title:
- Project:
- Inventron
- Electronics and Software
- Size:
- Date:
- Drawn By:
- Revision:
- Checked By:
- A4
- Sheet
- Time:
- of
- Budotek Teknopark
- Dudullu OSB
- Des 2. Cadde No:8/30
- ©2020 Inventron Electronics and Software. All rights reserved.
- Umraniye / ISTANBUL

## Nets that join several sheets
+1.8V_VDD: 06 MIPI-DSI to HDMI (14 pins), 10 BOOT (R1031.1 R1032.1), 01 SoM IO INTERFACE (12 pins)
+3.3V_EXT: 06 MIPI-DSI to HDMI (L607.1), 07 MIPI CSI (L701.2), 08 USB OTG & POWER (L805.2 TP808.1)
+3.3V_VDD: 05 MICROSD (C500.1 Q500.2 R500.2), 06 MIPI-DSI to HDMI (6 pins), 10 BOOT (17 pins), 11 EXPANSION CN (J1101.4 J1102.6 J1105.4), 12 CONSOLE (L1204.2 L1205.1 R1200.1), 01 SoM IO INTERFACE (17 pins)
+5V: 06 MIPI-DSI to HDMI (7 pins), 08 USB OTG & POWER (6 pins), 09 USB HUB (F901.1), 11 EXPANSION CN (5 pins), 12 CONSOLE (L1200.2), 01 SoM IO INTERFACE (11 pins)
+VBACKUP: 08 USB OTG & POWER (CON801.1 D804.K R806.1), 01 SoM IO INTERFACE (CON101.36 TP114.1)
CHASIS: 06 MIPI-DSI to HDMI (CON602.G1 CON602.G2 CON602.G3 CON602.G4), 08 USB OTG & POWER (CON803.S1 CON803.S2 CON803.S3 CON803.S4), 09 USB HUB (J900.S)
GND: 05 MICROSD (9 pins), 06 MIPI-DSI to HDMI (56 pins), 07 MIPI CSI (10 pins), 08 USB OTG & POWER (31 pins), 09 USB HUB (C901.2 D901.1 D904.2 L902.2), 10 BOOT (24 pins), 11 EXPANSION CN (16 pins), 12 CONSOLE (13 pins), 01 SoM IO INTERFACE (60 pins)
+3.3V_EXT_ENABLE: 08 USB OTG & POWER (R813.1), 01 SoM IO INTERFACE (R112.2)
DISP_CON_O1: 06 MIPI-DSI to HDMI (CON600.18), 01 SoM IO INTERFACE (R113.1)
DISP_CON_O2: 06 MIPI-DSI to HDMI (CON600.19), 01 SoM IO INTERFACE (R116.1)
DSI/LVDS_CON_INT: 06 MIPI-DSI to HDMI (Q600.3), 01 SoM IO INTERFACE (CON100.72)
DSI_GPIO: 06 MIPI-DSI to HDMI (R604.1), 01 SoM IO INTERFACE (CON100.94)
ECSPI2_MISO_3V3: 11 EXPANSION CN (U.12), 01 SoM IO INTERFACE (CON100.16)
ECSPI2_MOSI_3V3: 11 EXPANSION CN (U.11), 01 SoM IO INTERFACE (CON100.18)
ECSPI2_SCLK_3V3: 11 EXPANSION CN (U.13), 01 SoM IO INTERFACE (CON100.14)
ECSPI2_SS0_3V3: 11 EXPANSION CN (U.10), 01 SoM IO INTERFACE (CON100.12)
GPIO_EXP_1: 11 EXPANSION CN (Q1101.1 R1108.2), 01 SoM IO INTERFACE (CON101.54)
GPIO_EXP_2: 11 EXPANSION CN (J1102.1 R1103.2), 01 SoM IO INTERFACE (CON101.60)
GPIO_EXP_3: 11 EXPANSION CN (J1102.2 R1104.2), 01 SoM IO INTERFACE (CON101.74)
GPIO_EXP_4: 11 EXPANSION CN (J1102.3 R1105.1), 01 SoM IO INTERFACE (CON101.56)
GPIO_EXP_5: 11 EXPANSION CN (J1102.4 R1110.2), 01 SoM IO INTERFACE (CON101.93)
GPIO_EXP_6: 11 EXPANSION CN (J1102.5 R1111.2), 01 SoM IO INTERFACE (CON101.97)
GPIO_EXP_7: 11 EXPANSION CN (Q1100.1 R1100.2), 01 SoM IO INTERFACE (CON101.58)
HDMI_HPD: 06 MIPI-DSI to HDMI (Q601.2 R627.2 TP603.1 U600.14), 01 SoM IO INTERFACE (CON100.48)
I2C2_SCL_3V3: 06 MIPI-DSI to HDMI (Q602.3 R628.1), 07 MIPI CSI (R702.2), 01 SoM IO INTERFACE (CON100.22 R100.1 TP100.1)
I2C2_SDA_3V3: 06 MIPI-DSI to HDMI (Q602.6 R626.1), 07 MIPI CSI (R704.2), 01 SoM IO INTERFACE (CON100.24 R102.1 TP101.1)
I2C3_SCL_3V3: 06 MIPI-DSI to HDMI (CON600.22 Q603.1 R630.1), 01 SoM IO INTERFACE (CON100.30 R103.1 TP102.1)
I2C3_SDA_3V3: 06 MIPI-DSI to HDMI (CON600.23 Q603.4 R634.1), 01 SoM IO INTERFACE (CON100.34 R104.1 TP103.1)
I2C4_SCL_3V3: 07 MIPI CSI (R703.2), 11 EXPANSION CN (R1115.1), 01 SoM IO INTERFACE (CON100.26 R105.1 TP104.1)
I2C4_SDA_3V3: 07 MIPI CSI (R705.2), 11 EXPANSION CN (R1114.1), 01 SoM IO INTERFACE (CON100.28 R106.1 TP105.1)
IRQ_HDMI: 06 MIPI-DSI to HDMI (U600.63), 01 SoM IO INTERFACE (CON101.39)
MIPI_CSI_CLK_N: 07 MIPI CSI (CON700.5 TP702.1), 01 SoM IO INTERFACE (CON100.53)
MIPI_CSI_CLK_P: 07 MIPI CSI (CON700.6 TP703.1), 01 SoM IO INTERFACE (CON100.51)
MIPI_CSI_D0_N: 07 MIPI CSI (CON700.2 TP700.1), 01 SoM IO INTERFACE (CON100.59)
MIPI_CSI_D0_P: 07 MIPI CSI (CON700.3 TP701.1), 01 SoM IO INTERFACE (CON100.57)
MIPI_CSI_D1_N: 07 MIPI CSI (CON700.8), 01 SoM IO INTERFACE (CON100.47)
MIPI_CSI_D1_P: 07 MIPI CSI (CON700.9), 01 SoM IO INTERFACE (CON100.45)
MIPI_CSI_D2_N: 07 MIPI CSI (CON700.11), 01 SoM IO INTERFACE (CON100.41)
MIPI_CSI_D2_P: 07 MIPI CSI (CON700.12), 01 SoM IO INTERFACE (CON100.39)
MIPI_CSI_D3_N: 07 MIPI CSI (CON700.14), 01 SoM IO INTERFACE (CON100.35)
MIPI_CSI_D3_P: 07 MIPI CSI (CON700.15), 01 SoM IO INTERFACE (CON100.33)
MIPI_DSI_CK_N: 06 MIPI-DSI to HDMI (R641.1 U600.8), 01 SoM IO INTERFACE (CON100.15)
MIPI_DSI_CK_P: 06 MIPI-DSI to HDMI (R639.1 U600.7), 01 SoM IO INTERFACE (CON100.17)
MIPI_DSI_D0_N: 06 MIPI-DSI to HDMI (R607.1 U600.2), 01 SoM IO INTERFACE (CON100.27)
MIPI_DSI_D0_P: 06 MIPI-DSI to HDMI (R605.1 U600.1), 01 SoM IO INTERFACE (CON100.29)
MIPI_DSI_D1_N: 06 MIPI-DSI to HDMI (R637.1 U600.4), 01 SoM IO INTERFACE (CON100.21)
MIPI_DSI_D1_P: 06 MIPI-DSI to HDMI (R635.1 U600.3), 01 SoM IO INTERFACE (CON100.23)
MIPI_DSI_D2_N: 06 MIPI-DSI to HDMI (R645.1 U600.10), 01 SoM IO INTERFACE (CON100.9)
MIPI_DSI_D2_P: 06 MIPI-DSI to HDMI (R643.1 U600.9), 01 SoM IO INTERFACE (CON100.11)
MIPI_DSI_D3_N: 06 MIPI-DSI to HDMI (R649.1 U600.12), 01 SoM IO INTERFACE (CON100.3)
MIPI_DSI_D3_P: 06 MIPI-DSI to HDMI (R647.1 U600.11), 01 SoM IO INTERFACE (CON100.5)
nRESET_HDMI: 06 MIPI-DSI to HDMI (C640.1 R632.1 U600.64), 01 SoM IO INTERFACE (CON101.41)
ONOFF: 10 BOOT (CON1001.1 SW1001.2 TP1001.1), 01 SoM IO INTERFACE (CON100.46)
PWDN_CAM_C: 07 MIPI CSI (CON700.17), 01 SoM IO INTERFACE (R114.2)
PWM1_E: 06 MIPI-DSI to HDMI (CON600.20), 01 SoM IO INTERFACE (CON100.62)
PWM3_E: 07 MIPI CSI (R701.2), 01 SoM IO INTERFACE (CON100.66)
RST_CAM_C: 07 MIPI CSI (CON700.23), 01 SoM IO INTERFACE (R111.2)
SAI1_RXD0: 10 BOOT (R1000.1 R1003.2), 01 SoM IO INTERFACE (CON101.81)
SAI1_RXD1: 10 BOOT (R1001.1 R1004.2), 01 SoM IO INTERFACE (CON101.49 R111.1)
SAI1_RXD2: 10 BOOT (R1006.1 R1009.2), 01 SoM IO INTERFACE (CON101.51 R112.1)
SAI1_RXD3: 10 BOOT (R1007.1 R1010.2), 01 SoM IO INTERFACE (CON101.53 R114.1)
SAI1_RXD4: 10 BOOT (R1014.1 R1034.1 R1038.2), 01 SoM IO INTERFACE (CON101.55)
SAI1_RXD5: 10 BOOT (R1019.1 R1036.1 R1040.2), 01 SoM IO INTERFACE (CON101.57)
SAI1_RXD6: 10 BOOT (R1008.1 R1011.2), 01 SoM IO INTERFACE (CON101.61 R116.2)
SAI1_RXD7: 10 BOOT (R1015.1 R1020.2), 01 SoM IO INTERFACE (CON101.63)
SAI1_TXD0: 10 BOOT (R1016.1 R1021.2), 01 SoM IO INTERFACE (CON101.89)
SAI1_TXD1: 10 BOOT (R1002.1 R1005.2), 01 SoM IO INTERFACE (CON101.65 R113.2)
SAI1_TXD2: 10 BOOT (R1013.1 R1033.1 R1037.2), 01 SoM IO INTERFACE (CON101.67)
SAI1_TXD3: 10 BOOT (R1023.1 R1041.1 R1043.2), 01 SoM IO INTERFACE (CON101.69)
SAI1_TXD4: 10 BOOT (R1012.1 R1035.1 R1039.2), 01 SoM IO INTERFACE (CON101.73)
SAI1_TXD5: 10 BOOT (R1024.1 R1042.1 R1044.2), 01 SoM IO INTERFACE (CON101.75)
SAI1_TXD6: 10 BOOT (R1017.1 R1022.2), 01 SoM IO INTERFACE (CON101.77)
SAI1_TXD7: 10 BOOT (R1026.1 R1029.2), 01 SoM IO INTERFACE (CON101.79)
SAI2_TXC: 06 MIPI-DSI to HDMI (U600.60), 01 SoM IO INTERFACE (CON101.42)
SAI2_TXD: 06 MIPI-DSI to HDMI (U600.58), 01 SoM IO INTERFACE (CON101.46)
SAI2_TXFS: 06 MIPI-DSI to HDMI (U600.59), 01 SoM IO INTERFACE (CON101.44)
SD2_CD_B: 05 MICROSD (R507.1), 01 SoM IO INTERFACE (CON100.76)
SD2_CLK: 05 MICROSD (R510.1), 01 SoM IO INTERFACE (CON100.82)
SD2_CMD: 05 MICROSD (R511.1), 01 SoM IO INTERFACE (CON100.84)
SD2_DATA0: 05 MICROSD (R509.1), 01 SoM IO INTERFACE (CON100.78)
SD2_DATA1: 05 MICROSD (R508.1), 01 SoM IO INTERFACE (CON100.74)
SD2_DATA2: 05 MICROSD (R513.1), 01 SoM IO INTERFACE (CON100.88)
SD2_DATA3: 05 MICROSD (R512.1), 01 SoM IO INTERFACE (CON100.86)
SD2_nRST: 05 MICROSD (Q500.1 R500.1), 01 SoM IO INTERFACE (CON100.90)
SYS_BOOT_MODE0: 10 BOOT (CON1000.5 R1028.2), 01 SoM IO INTERFACE (CON101.45)
SYS_BOOT_MODE1: 10 BOOT (CON1000.7 R1027.2), 01 SoM IO INTERFACE (CON101.43)
SYS_nRST: 10 BOOT (SW1000.3 SW1000.4 TP1000.1), 01 SoM IO INTERFACE (CON101.33)
UART2_RXD: 12 CONSOLE (R1203.1), 01 SoM IO INTERFACE (CON101.94)
UART2_TXD: 12 CONSOLE (R1202.2), 01 SoM IO INTERFACE (CON101.96)
UART3_RX_3V3: 11 EXPANSION CN (R1113.1), 01 SoM IO INTERFACE (CON100.4)
UART3_TX_3V3: 11 EXPANSION CN (R1112.1), 01 SoM IO INTERFACE (CON100.6)
UART4_RXD: 12 CONSOLE (D1203.1 R1210.1), 01 SoM IO INTERFACE (CON101.92)
UART4_TXD: 12 CONSOLE (R1205.2), 01 SoM IO INTERFACE (CON101.88)
USB2_UP_N: 09 USB HUB (L904.3), 01 SoM IO INTERFACE (CON100.93)
USB2_UP_P: 09 USB HUB (L904.2), 01 SoM IO INTERFACE (CON100.95)